# Altium project T0017_HPC_UFL_DEBUG_BOARD.PrjPcb (part 1 of 2)
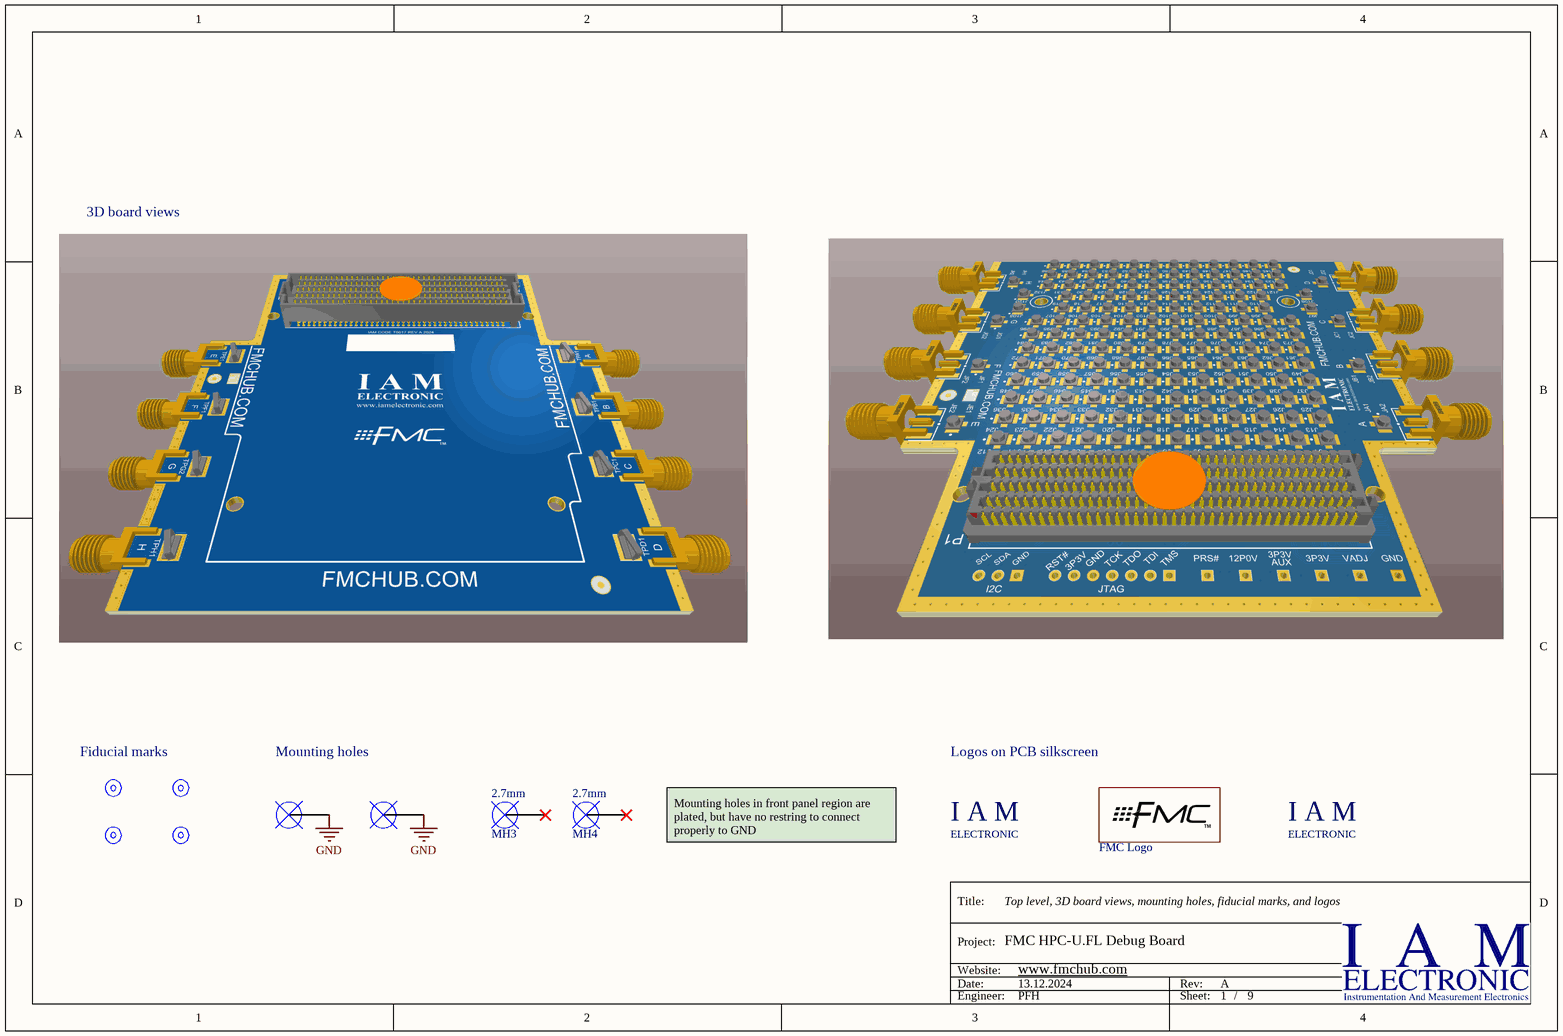
[diagram p0: FMC_HPC_UFL_DEBUG_TOP.SchDoc]
9 sheets, 201 parts. Net scope: global (net labels, ports and power ports of the same name join across sheets).
Board file: FMC_HPC_UFL_DEBUG_BOARD.PcbDoc
Sheets:
  FMC_HPC_UFL_DEBUG_TOP.SchDoc
  FMC_HPC_UFL_DEBUG_J1_J84.SchDoc
  FMC_HPC_UFL_DEBUG_J85_J156.SchDoc
  FMC_HPC_UFL_DEBUG_TP_SMA.SchDoc
  FMC_HPC_UFL_DEBUG_HPC_AB.SchDoc
  FMC_HPC_UFL_DEBUG_HPC_CD.SchDoc
  FMC_HPC_UFL_DEBUG_HPC_EF.SchDoc
  FMC_HPC_UFL_DEBUG_HPC_GH.SchDoc
  FMC_HPC_UFL_DEBUG_HPC_JK.SchDoc

## Sheet FMC_HPC_UFL_DEBUG_TOP.SchDoc: Top level, 3D board views, mounting holes, fiducial marks, and logos
size A4; Date: 13.12.2024; ApprovedBy: PFH; CompanyName: IAM Electronic GmbH; DrawnBy: PFH; Engineer: PFH; DocumentNumber: 1; Revision: A; SheetNumber: 1; SheetTotal: 9; Projekt: FMC HPC-U.FL Debug Board; Website: www.fmchub.com

### Parts
FM1  1mm  [FIDUCIAL_MARK_ROUND_RING]  (value not drawn)  (no BOM)
FM2  1mm  [FIDUCIAL_MARK_ROUND_RING]  (value not drawn)  (no BOM)
FM3  1mm  [FIDUCIAL_MARK_ROUND_RING]  (value not drawn)  (no BOM)
FM4  1mm  [FIDUCIAL_MARK_ROUND_RING]  (value not drawn)  (no BOM)
MH1  2.7mm  [Mounting_Hole_Plated_2.7mm-COVERED]  (value not drawn)  (no BOM)
MH2  2.7mm  [Mounting_Hole_Plated_2.7mm-COVERED]  (value not drawn)  (no BOM)
MH3  2.7mm  [Mounting_Hole_Plated_2.7mm - d3.1mm]  (no BOM)
MH4  2.7mm  [Mounting_Hole_Plated_2.7mm - d3.1mm]  (no BOM)
STR1  IAM LOGO  [IAM LOGO - LARGE - WWW]  (value not drawn)  (no BOM)
STR2  FMC Logo  [FMC_TM_LOGO_MEDIUM]  (no BOM)
STR3  IAM LOGO  [IAM LOGO - SMALL - WWW]  (value not drawn)  (no BOM)

### Nets
GND: MH1.0 MH2.0

Not connected (* = marked no-connect by the designer): FM1 FD0; FM2 FD0; FM3 FD0; FM4 FD0; MH3 0*; MH4 0*

### Notes on the sheet
- 3D board views
- Fiducial marks
- Mounting holes
- Logos on PCB silkscreen
- Mounting holes in front panel region are plated, but have no restring to connect properly to GND
- Title:
- Project:
- Date:
- Website:
- Rev:
- Engineer:
- Sheet:
- /
- (in symbol IAM_LOGO) I A M; ELECTRONIC

### Library data of the parts
FM1-FM4 = Fiducial_Mark: Fiducial mark, width 1mm, clearance 3mm; Width: 1 mm; Clearance: 3 mm
MH1-MH4 = Mounting_Hole_2.7mm: Mounting hole, hole size 2.7mm; Hole radius: 2.7 mm; Diameter (plated): *; Keep out (radius): *; Plated: *
STR1 STR3 = IAM_LOGO: I A M E L E C T R O N I C - Logo; Layer: Top Overlay; Manufacturer: IAM ELECTRONIC; Part: Logo
STR2 = FMC_Logo: VITA FMC Logo

## Sheet FMC_HPC_UFL_DEBUG_J1_J84.SchDoc: 84 U.FL connectors J1 .. J84 (12 x 7 array)
size A4; Date: 13.12.2024; ApprovedBy: PFH; CompanyName: IAM Electronic GmbH; DrawnBy: PFH; Engineer: PFH; DocumentNumber: 2; Revision: A; SheetNumber: 2; SheetTotal: 9; Projekt: FMC HPC-U.FL Debug Board; Website: www.fmchub.com
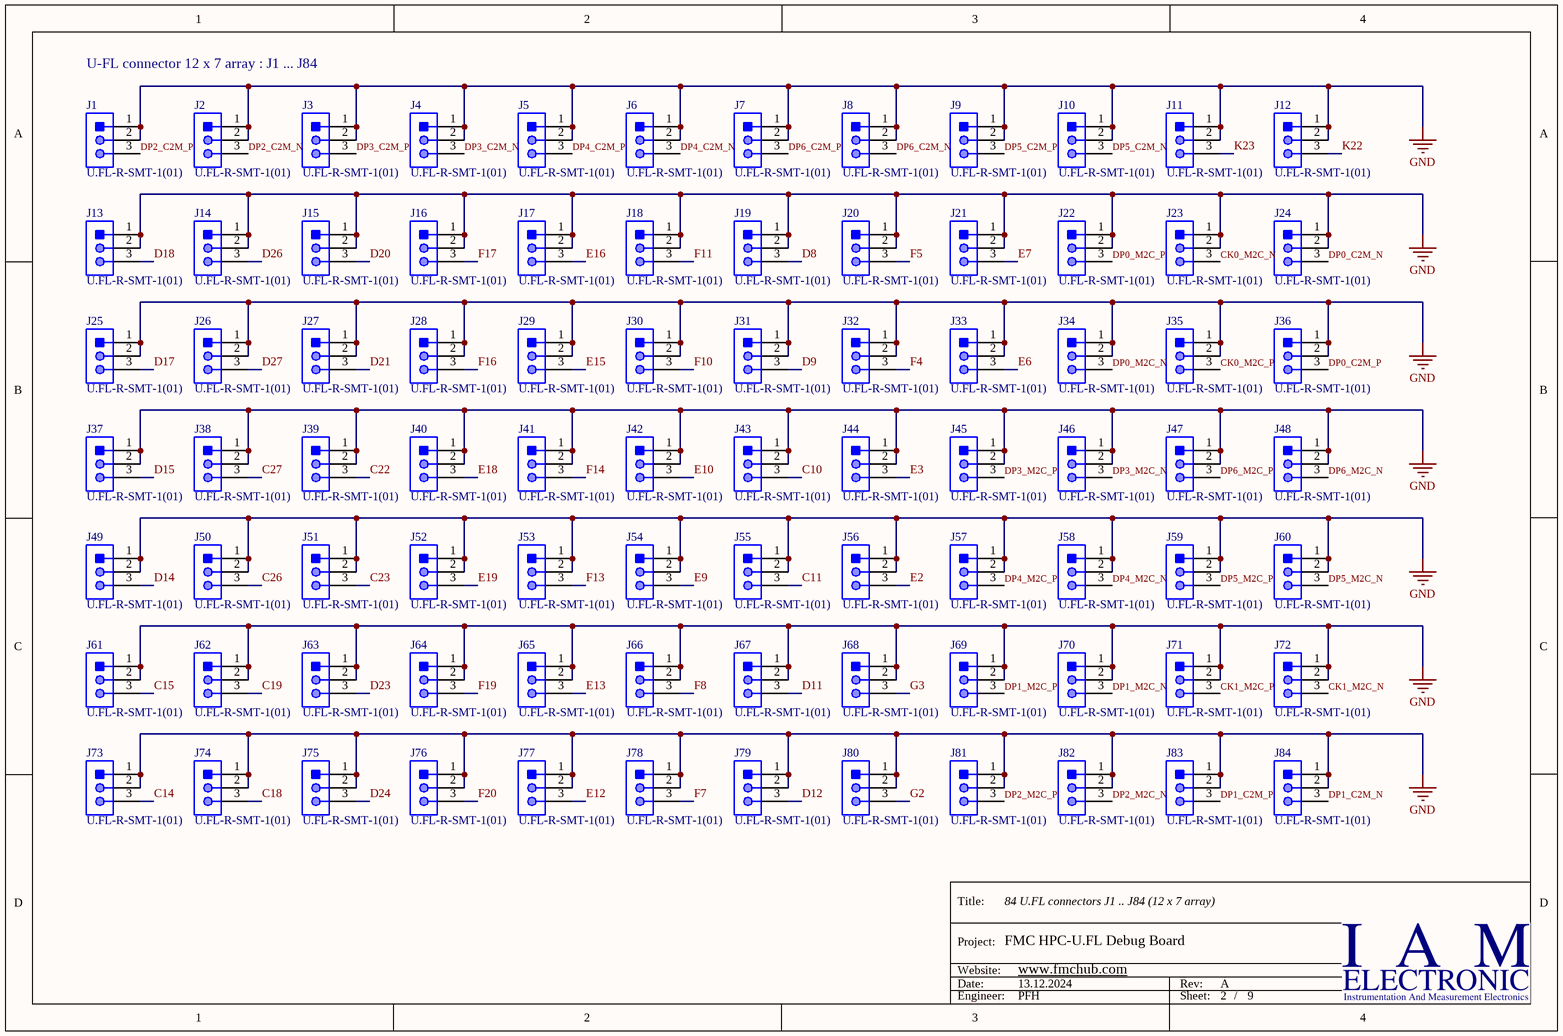
[diagram p1: FMC_HPC_UFL_DEBUG_J1_J84.SchDoc]

### Parts
J1  U.FL-R-SMT-1(01)  [HRS-U.FL-R-SMT-3_V]
J2  U.FL-R-SMT-1(01)  [HRS-U.FL-R-SMT-3_V]
J3  U.FL-R-SMT-1(01)  [HRS-U.FL-R-SMT-3_V]
J4  U.FL-R-SMT-1(01)  [HRS-U.FL-R-SMT-3_V]
J5  U.FL-R-SMT-1(01)  [HRS-U.FL-R-SMT-3_V]
J6  U.FL-R-SMT-1(01)  [HRS-U.FL-R-SMT-3_V]
J7  U.FL-R-SMT-1(01)  [HRS-U.FL-R-SMT-3_V]
J8  U.FL-R-SMT-1(01)  [HRS-U.FL-R-SMT-3_V]
J9  U.FL-R-SMT-1(01)  [HRS-U.FL-R-SMT-3_V]
J10  U.FL-R-SMT-1(01)  [HRS-U.FL-R-SMT-3_V]
J11  U.FL-R-SMT-1(01)  [HRS-U.FL-R-SMT-3_V]
J12  U.FL-R-SMT-1(01)  [HRS-U.FL-R-SMT-3_V]
J13  U.FL-R-SMT-1(01)  [HRS-U.FL-R-SMT-3_V]
J14  U.FL-R-SMT-1(01)  [HRS-U.FL-R-SMT-3_V]
J15  U.FL-R-SMT-1(01)  [HRS-U.FL-R-SMT-3_V]
J16  U.FL-R-SMT-1(01)  [HRS-U.FL-R-SMT-3_V]
J17  U.FL-R-SMT-1(01)  [HRS-U.FL-R-SMT-3_V]
J18  U.FL-R-SMT-1(01)  [HRS-U.FL-R-SMT-3_V]
J19  U.FL-R-SMT-1(01)  [HRS-U.FL-R-SMT-3_V]
J20  U.FL-R-SMT-1(01)  [HRS-U.FL-R-SMT-3_V]
J21  U.FL-R-SMT-1(01)  [HRS-U.FL-R-SMT-3_V]
J22  U.FL-R-SMT-1(01)  [HRS-U.FL-R-SMT-3_V]
J23  U.FL-R-SMT-1(01)  [HRS-U.FL-R-SMT-3_V]
J24  U.FL-R-SMT-1(01)  [HRS-U.FL-R-SMT-3_V]
J25  U.FL-R-SMT-1(01)  [HRS-U.FL-R-SMT-3_V]
J26  U.FL-R-SMT-1(01)  [HRS-U.FL-R-SMT-3_V]
J27  U.FL-R-SMT-1(01)  [HRS-U.FL-R-SMT-3_V]
J28  U.FL-R-SMT-1(01)  [HRS-U.FL-R-SMT-3_V]
J29  U.FL-R-SMT-1(01)  [HRS-U.FL-R-SMT-3_V]
J30  U.FL-R-SMT-1(01)  [HRS-U.FL-R-SMT-3_V]
J31  U.FL-R-SMT-1(01)  [HRS-U.FL-R-SMT-3_V]
J32  U.FL-R-SMT-1(01)  [HRS-U.FL-R-SMT-3_V]
J33  U.FL-R-SMT-1(01)  [HRS-U.FL-R-SMT-3_V]
J34  U.FL-R-SMT-1(01)  [HRS-U.FL-R-SMT-3_V]
J35  U.FL-R-SMT-1(01)  [HRS-U.FL-R-SMT-3_V]
J36  U.FL-R-SMT-1(01)  [HRS-U.FL-R-SMT-3_V]
J37  U.FL-R-SMT-1(01)  [HRS-U.FL-R-SMT-3_V]
J38  U.FL-R-SMT-1(01)  [HRS-U.FL-R-SMT-3_V]
J39  U.FL-R-SMT-1(01)  [HRS-U.FL-R-SMT-3_V]
J40  U.FL-R-SMT-1(01)  [HRS-U.FL-R-SMT-3_V]
J41  U.FL-R-SMT-1(01)  [HRS-U.FL-R-SMT-3_V]
J42  U.FL-R-SMT-1(01)  [HRS-U.FL-R-SMT-3_V]
J43  U.FL-R-SMT-1(01)  [HRS-U.FL-R-SMT-3_V]
J44  U.FL-R-SMT-1(01)  [HRS-U.FL-R-SMT-3_V]
J45  U.FL-R-SMT-1(01)  [HRS-U.FL-R-SMT-3_V]
J46  U.FL-R-SMT-1(01)  [HRS-U.FL-R-SMT-3_V]
J47  U.FL-R-SMT-1(01)  [HRS-U.FL-R-SMT-3_V]
J48  U.FL-R-SMT-1(01)  [HRS-U.FL-R-SMT-3_V]
J49  U.FL-R-SMT-1(01)  [HRS-U.FL-R-SMT-3_V]
J50  U.FL-R-SMT-1(01)  [HRS-U.FL-R-SMT-3_V]
J51  U.FL-R-SMT-1(01)  [HRS-U.FL-R-SMT-3_V]
J52  U.FL-R-SMT-1(01)  [HRS-U.FL-R-SMT-3_V]
J53  U.FL-R-SMT-1(01)  [HRS-U.FL-R-SMT-3_V]
J54  U.FL-R-SMT-1(01)  [HRS-U.FL-R-SMT-3_V]
J55  U.FL-R-SMT-1(01)  [HRS-U.FL-R-SMT-3_V]
J56  U.FL-R-SMT-1(01)  [HRS-U.FL-R-SMT-3_V]
J57  U.FL-R-SMT-1(01)  [HRS-U.FL-R-SMT-3_V]
J58  U.FL-R-SMT-1(01)  [HRS-U.FL-R-SMT-3_V]
J59  U.FL-R-SMT-1(01)  [HRS-U.FL-R-SMT-3_V]
J60  U.FL-R-SMT-1(01)  [HRS-U.FL-R-SMT-3_V]
J61  U.FL-R-SMT-1(01)  [HRS-U.FL-R-SMT-3_V]
J62  U.FL-R-SMT-1(01)  [HRS-U.FL-R-SMT-3_V]
J63  U.FL-R-SMT-1(01)  [HRS-U.FL-R-SMT-3_V]
J64  U.FL-R-SMT-1(01)  [HRS-U.FL-R-SMT-3_V]
J65  U.FL-R-SMT-1(01)  [HRS-U.FL-R-SMT-3_V]
J66  U.FL-R-SMT-1(01)  [HRS-U.FL-R-SMT-3_V]
J67  U.FL-R-SMT-1(01)  [HRS-U.FL-R-SMT-3_V]
J68  U.FL-R-SMT-1(01)  [HRS-U.FL-R-SMT-3_V]
J69  U.FL-R-SMT-1(01)  [HRS-U.FL-R-SMT-3_V]
J70  U.FL-R-SMT-1(01)  [HRS-U.FL-R-SMT-3_V]
J71  U.FL-R-SMT-1(01)  [HRS-U.FL-R-SMT-3_V]
J72  U.FL-R-SMT-1(01)  [HRS-U.FL-R-SMT-3_V]
J73  U.FL-R-SMT-1(01)  [HRS-U.FL-R-SMT-3_V]
J74  U.FL-R-SMT-1(01)  [HRS-U.FL-R-SMT-3_V]
J75  U.FL-R-SMT-1(01)  [HRS-U.FL-R-SMT-3_V]
J76  U.FL-R-SMT-1(01)  [HRS-U.FL-R-SMT-3_V]
J77  U.FL-R-SMT-1(01)  [HRS-U.FL-R-SMT-3_V]
J78  U.FL-R-SMT-1(01)  [HRS-U.FL-R-SMT-3_V]
J79  U.FL-R-SMT-1(01)  [HRS-U.FL-R-SMT-3_V]
J80  U.FL-R-SMT-1(01)  [HRS-U.FL-R-SMT-3_V]
J81  U.FL-R-SMT-1(01)  [HRS-U.FL-R-SMT-3_V]
J82  U.FL-R-SMT-1(01)  [HRS-U.FL-R-SMT-3_V]
J83  U.FL-R-SMT-1(01)  [HRS-U.FL-R-SMT-3_V]
J84  U.FL-R-SMT-1(01)  [HRS-U.FL-R-SMT-3_V]

### Nets
GND: J1.1 J1.2 J2.1 J2.2 J3.1 J3.2 J4.1 J4.2 J5.1 J5.2 J6.1 J6.2 J7.1 J7.2 J8.1 J8.2 J9.1 J9.2 J10.1 J10.2 J11.1 J11.2 J12.1 J12.2 J13.1 J13.2 J14.1 J14.2 J15.1 J15.2 J16.1 J16.2 J17.1 J17.2 J18.1 J18.2 J19.1 J19.2 J20.1 J20.2 J21.1 J21.2 J22.1 J22.2 J23.1 J23.2 J24.1 J24.2 J25.1 J25.2 J26.1 J26.2 J27.1 J27.2 J28.1 J28.2 J29.1 J29.2 J30.1 J30.2 J31.1 J31.2 J32.1 J32.2 J33.1 J33.2 J34.1 J34.2 J35.1 J35.2 J36.1 J36.2 J37.1 J37.2 J38.1 J38.2 J39.1 J39.2 J40.1 J40.2 J41.1 J41.2 J42.1 J42.2 J43.1 J43.2 J44.1 J44.2 J45.1 J45.2 J46.1 J46.2 J47.1 J47.2 J48.1 J48.2 J49.1 J49.2 J50.1 J50.2 J51.1 J51.2 J52.1 J52.2 J53.1 J53.2 J54.1 J54.2 J55.1 J55.2 J56.1 J56.2 J57.1 J57.2 J58.1 J58.2 J59.1 J59.2 J60.1 J60.2 J61.1 J61.2 J62.1 J62.2 J63.1 J63.2 J64.1 J64.2 J65.1 J65.2 J66.1 J66.2 J67.1 J67.2 J68.1 J68.2 J69.1 J69.2 J70.1 J70.2 J71.1 J71.2 J72.1 J72.2 J73.1 J73.2 J74.1 J74.2 J75.1 J75.2 J76.1 J76.2 J77.1 J77.2 J78.1 J78.2 J79.1 J79.2 J80.1 J80.2 J81.1 J81.2 J82.1 J82.2 J83.1 J83.2 J84.1 J84.2
C10: J43.3
C11: J55.3
C14: J73.3
C15: J61.3
C18: J74.3
C19: J62.3
C22: J39.3
C23: J51.3
C26: J50.3
C27: J38.3
CK0_M2C_N: J23.3
CK0_M2C_P: J35.3
CK1_M2C_N: J72.3
CK1_M2C_P: J71.3
D8: J19.3
D9: J31.3
D11: J67.3
D12: J79.3
D14: J49.3
D15: J37.3
D17: J25.3
D18: J13.3
D20: J15.3
D21: J27.3
D23: J63.3
D24: J75.3
D26: J14.3
D27: J26.3
DP0_C2M_N: J24.3
DP0_C2M_P: J36.3
DP0_M2C_N: J34.3
DP0_M2C_P: J22.3
DP1_C2M_N: J84.3
DP1_C2M_P: J83.3
DP1_M2C_N: J70.3
DP1_M2C_P: J69.3
DP2_C2M_N: J2.3
DP2_C2M_P: J1.3
DP2_M2C_N: J82.3
DP2_M2C_P: J81.3
DP3_C2M_N: J4.3
DP3_C2M_P: J3.3
DP3_M2C_N: J46.3
DP3_M2C_P: J45.3
DP4_C2M_N: J6.3
DP4_C2M_P: J5.3
DP4_M2C_N: J58.3
DP4_M2C_P: J57.3
DP5_C2M_N: J10.3
DP5_C2M_P: J9.3
DP5_M2C_N: J60.3
DP5_M2C_P: J59.3
DP6_C2M_N: J8.3
DP6_C2M_P: J7.3
DP6_M2C_N: J48.3
DP6_M2C_P: J47.3
E2: J56.3
E3: J44.3
E6: J33.3
E7: J21.3
E9: J54.3
E10: J42.3
E12: J77.3
E13: J65.3
E15: J29.3
E16: J17.3
E18: J40.3
E19: J52.3
F4: J32.3
F5: J20.3
F7: J78.3
F8: J66.3
F10: J30.3
F11: J18.3
F13: J53.3
F14: J41.3
F16: J28.3
F17: J16.3
F19: J64.3
F20: J76.3
G2: J80.3
G3: J68.3
K22: J12.3
K23: J11.3

### Notes on the sheet
- U-FL connector 12 x 7 array : J1 ... J84
- Title:
- Project:
- Date:
- Website:
- Rev:
- Engineer:
- Sheet:
- /

### Library data of the parts
J1-J84 = CMP-2000-05153-1: Ultra Small Coaxial Connector, 6 GHz, -40 to 90 degC, 3-Pin SMD, RoHS, Bulk; Manufacturer: Hirose Electric; Connector Style: U.FL; Impedance: 50Ohm; Dielectric Material: LiquidCrystalPolymer(LCP); Minimum Quantity: UltraMiniatureCoaxial; Online Catalog: U.FLSeries; Featured Product: HiroseU.FLSeries; Frequency - Max: 6GHz; Other Names: H122041 / U.FL-R-SMT-1(01)-ND; Contact Termination: Solder; Body Material: PhosphorBronze; Connector Type: Jack,MalePin; Body Finish: Silver; Center Contact Plating: Gold; Manufacturer URL: https://www.hirose.com; Family: CoaxialConnectors(RF); Fastening Type: Snap-On; Unit PriceUSD: U.FL; Series: U.FL; Package Reference: U.FL-R-SMT; Packaging: Bulk; Standard Package: 100; Mounting Type: SurfaceMount; Quantity Available: Bulk; Housing Color: Silver; Package Description: 3-Pin Surface Mount Device, Body 2.6 x 2.6 mm; Category: Connectors,Interconnects; Operating Temperature: -40degC~90degC; Center Contact Material: PhosphorBronze; Dynamic Catalog: U.FLSeries; Datasheet URL: https://datasheet.ciiva.com/26945/getdatasheetpartid-475239-26945414.pdf; Datasheet Version: Feb-09; Shield Termination: Solder; Part: U.FL-R-SMT-1(01); Part2: 331-0472-2 01

## Sheet FMC_HPC_UFL_DEBUG_J85_J156.SchDoc: 72 U.FL connectors J85 .. J144 (12 x 6 array)
size A4; Date: 13.12.2024; ApprovedBy: PFH; CompanyName: IAM Electronic GmbH; DrawnBy: PFH; Engineer: PFH; DocumentNumber: 3; Revision: A; SheetNumber: 3; SheetTotal: 9; Projekt: FMC HPC-U.FL Debug Board; Website: www.fmchub.com
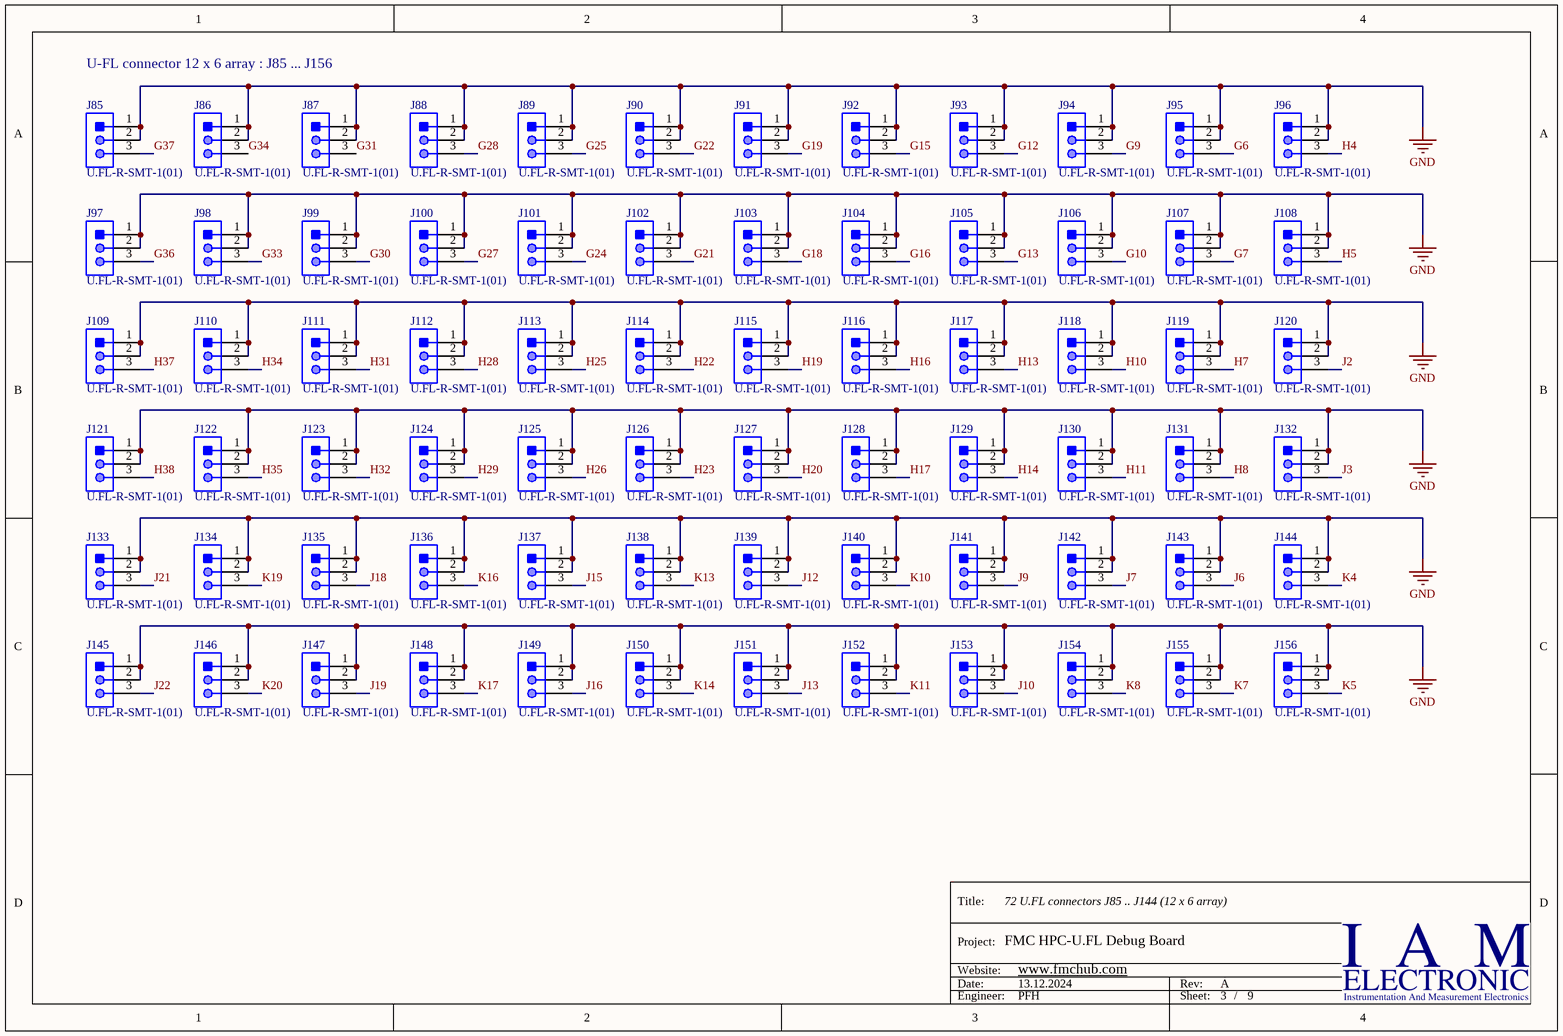
[diagram p2: FMC_HPC_UFL_DEBUG_J85_J156.SchDoc]

### Parts
J85  U.FL-R-SMT-1(01)  [HRS-U.FL-R-SMT-3_V]
J86  U.FL-R-SMT-1(01)  [HRS-U.FL-R-SMT-3_V]
J87  U.FL-R-SMT-1(01)  [HRS-U.FL-R-SMT-3_V]
J88  U.FL-R-SMT-1(01)  [HRS-U.FL-R-SMT-3_V]
J89  U.FL-R-SMT-1(01)  [HRS-U.FL-R-SMT-3_V]
J90  U.FL-R-SMT-1(01)  [HRS-U.FL-R-SMT-3_V]
J91  U.FL-R-SMT-1(01)  [HRS-U.FL-R-SMT-3_V]
J92  U.FL-R-SMT-1(01)  [HRS-U.FL-R-SMT-3_V]
J93  U.FL-R-SMT-1(01)  [HRS-U.FL-R-SMT-3_V]
J94  U.FL-R-SMT-1(01)  [HRS-U.FL-R-SMT-3_V]
J95  U.FL-R-SMT-1(01)  [HRS-U.FL-R-SMT-3_V]
J96  U.FL-R-SMT-1(01)  [HRS-U.FL-R-SMT-3_V]
J97  U.FL-R-SMT-1(01)  [HRS-U.FL-R-SMT-3_V]
J98  U.FL-R-SMT-1(01)  [HRS-U.FL-R-SMT-3_V]
J99  U.FL-R-SMT-1(01)  [HRS-U.FL-R-SMT-3_V]
J100  U.FL-R-SMT-1(01)  [HRS-U.FL-R-SMT-3_V]
J101  U.FL-R-SMT-1(01)  [HRS-U.FL-R-SMT-3_V]
J102  U.FL-R-SMT-1(01)  [HRS-U.FL-R-SMT-3_V]
J103  U.FL-R-SMT-1(01)  [HRS-U.FL-R-SMT-3_V]
J104  U.FL-R-SMT-1(01)  [HRS-U.FL-R-SMT-3_V]
J105  U.FL-R-SMT-1(01)  [HRS-U.FL-R-SMT-3_V]
J106  U.FL-R-SMT-1(01)  [HRS-U.FL-R-SMT-3_V]
J107  U.FL-R-SMT-1(01)  [HRS-U.FL-R-SMT-3_V]
J108  U.FL-R-SMT-1(01)  [HRS-U.FL-R-SMT-3_V]
J109  U.FL-R-SMT-1(01)  [HRS-U.FL-R-SMT-3_V]
J110  U.FL-R-SMT-1(01)  [HRS-U.FL-R-SMT-3_V]
J111  U.FL-R-SMT-1(01)  [HRS-U.FL-R-SMT-3_V]
J112  U.FL-R-SMT-1(01)  [HRS-U.FL-R-SMT-3_V]
J113  U.FL-R-SMT-1(01)  [HRS-U.FL-R-SMT-3_V]
J114  U.FL-R-SMT-1(01)  [HRS-U.FL-R-SMT-3_V]
J115  U.FL-R-SMT-1(01)  [HRS-U.FL-R-SMT-3_V]
J116  U.FL-R-SMT-1(01)  [HRS-U.FL-R-SMT-3_V]
J117  U.FL-R-SMT-1(01)  [HRS-U.FL-R-SMT-3_V]
J118  U.FL-R-SMT-1(01)  [HRS-U.FL-R-SMT-3_V]
J119  U.FL-R-SMT-1(01)  [HRS-U.FL-R-SMT-3_V]
J120  U.FL-R-SMT-1(01)  [HRS-U.FL-R-SMT-3_V]
J121  U.FL-R-SMT-1(01)  [HRS-U.FL-R-SMT-3_V]
J122  U.FL-R-SMT-1(01)  [HRS-U.FL-R-SMT-3_V]
J123  U.FL-R-SMT-1(01)  [HRS-U.FL-R-SMT-3_V]
J124  U.FL-R-SMT-1(01)  [HRS-U.FL-R-SMT-3_V]
J125  U.FL-R-SMT-1(01)  [HRS-U.FL-R-SMT-3_V]
J126  U.FL-R-SMT-1(01)  [HRS-U.FL-R-SMT-3_V]
J127  U.FL-R-SMT-1(01)  [HRS-U.FL-R-SMT-3_V]
J128  U.FL-R-SMT-1(01)  [HRS-U.FL-R-SMT-3_V]
J129  U.FL-R-SMT-1(01)  [HRS-U.FL-R-SMT-3_V]
J130  U.FL-R-SMT-1(01)  [HRS-U.FL-R-SMT-3_V]
J131  U.FL-R-SMT-1(01)  [HRS-U.FL-R-SMT-3_V]
J132  U.FL-R-SMT-1(01)  [HRS-U.FL-R-SMT-3_V]
J133  U.FL-R-SMT-1(01)  [HRS-U.FL-R-SMT-3_V]
J134  U.FL-R-SMT-1(01)  [HRS-U.FL-R-SMT-3_V]
J135  U.FL-R-SMT-1(01)  [HRS-U.FL-R-SMT-3_V]
J136  U.FL-R-SMT-1(01)  [HRS-U.FL-R-SMT-3_V]
J137  U.FL-R-SMT-1(01)  [HRS-U.FL-R-SMT-3_V]
J138  U.FL-R-SMT-1(01)  [HRS-U.FL-R-SMT-3_V]
J139  U.FL-R-SMT-1(01)  [HRS-U.FL-R-SMT-3_V]
J140  U.FL-R-SMT-1(01)  [HRS-U.FL-R-SMT-3_V]
J141  U.FL-R-SMT-1(01)  [HRS-U.FL-R-SMT-3_V]
J142  U.FL-R-SMT-1(01)  [HRS-U.FL-R-SMT-3_V]
J143  U.FL-R-SMT-1(01)  [HRS-U.FL-R-SMT-3_V]
J144  U.FL-R-SMT-1(01)  [HRS-U.FL-R-SMT-3_V]
J145  U.FL-R-SMT-1(01)  [HRS-U.FL-R-SMT-3_V]
J146  U.FL-R-SMT-1(01)  [HRS-U.FL-R-SMT-3_V]
J147  U.FL-R-SMT-1(01)  [HRS-U.FL-R-SMT-3_V]
J148  U.FL-R-SMT-1(01)  [HRS-U.FL-R-SMT-3_V]
J149  U.FL-R-SMT-1(01)  [HRS-U.FL-R-SMT-3_V]
J150  U.FL-R-SMT-1(01)  [HRS-U.FL-R-SMT-3_V]
J151  U.FL-R-SMT-1(01)  [HRS-U.FL-R-SMT-3_V]
J152  U.FL-R-SMT-1(01)  [HRS-U.FL-R-SMT-3_V]
J153  U.FL-R-SMT-1(01)  [HRS-U.FL-R-SMT-3_V]
J154  U.FL-R-SMT-1(01)  [HRS-U.FL-R-SMT-3_V]
J155  U.FL-R-SMT-1(01)  [HRS-U.FL-R-SMT-3_V]
J156  U.FL-R-SMT-1(01)  [HRS-U.FL-R-SMT-3_V]

### Nets
GND: J85.1 J85.2 J86.1 J86.2 J87.1 J87.2 J88.1 J88.2 J89.1 J89.2 J90.1 J90.2 J91.1 J91.2 J92.1 J92.2 J93.1 J93.2 J94.1 J94.2 J95.1 J95.2 J96.1 J96.2 J97.1 J97.2 J98.1 J98.2 J99.1 J99.2 J100.1 J100.2 J101.1 J101.2 J102.1 J102.2 J103.1 J103.2 J104.1 J104.2 J105.1 J105.2 J106.1 J106.2 J107.1 J107.2 J108.1 J108.2 J109.1 J109.2 J110.1 J110.2 J111.1 J111.2 J112.1 J112.2 J113.1 J113.2 J114.1 J114.2 J115.1 J115.2 J116.1 J116.2 J117.1 J117.2 J118.1 J118.2 J119.1 J119.2 J120.1 J120.2 J121.1 J121.2 J122.1 J122.2 J123.1 J123.2 J124.1 J124.2 J125.1 J125.2 J126.1 J126.2 J127.1 J127.2 J128.1 J128.2 J129.1 J129.2 J130.1 J130.2 J131.1 J131.2 J132.1 J132.2 J133.1 J133.2 J134.1 J134.2 J135.1 J135.2 J136.1 J136.2 J137.1 J137.2 J138.1 J138.2 J139.1 J139.2 J140.1 J140.2 J141.1 J141.2 J142.1 J142.2 J143.1 J143.2 J144.1 J144.2 J145.1 J145.2 J146.1 J146.2 J147.1 J147.2 J148.1 J148.2 J149.1 J149.2 J150.1 J150.2 J151.1 J151.2 J152.1 J152.2 J153.1 J153.2 J154.1 J154.2 J155.1 J155.2 J156.1 J156.2
G6: J95.3
G7: J107.3
G9: J94.3
G10: J106.3
G12: J93.3
G13: J105.3
G15: J92.3
G16: J104.3
G18: J103.3
G19: J91.3
G21: J102.3
G22: J90.3
G24: J101.3
G25: J89.3
G27: J100.3
G28: J88.3
G30: J99.3
G31: J87.3
G33: J98.3
G34: J86.3
G36: J97.3
G37: J85.3
H4: J96.3
H5: J108.3
H7: J119.3
H8: J131.3
H10: J118.3
H11: J130.3
H13: J117.3
H14: J129.3
H16: J116.3
H17: J128.3
H19: J115.3
H20: J127.3
H22: J114.3
H23: J126.3
H25: J113.3
H26: J125.3
H28: J112.3
H29: J124.3
H31: J111.3
H32: J123.3
H34: J110.3
H35: J122.3
H37: J109.3
H38: J121.3
J2: J120.3
J3: J132.3
J6: J143.3
J7: J142.3
J9: J141.3
J10: J153.3
J12: J139.3
J13: J151.3
J15: J137.3
J16: J149.3
J18: J135.3
J19: J147.3
J21: J133.3
J22: J145.3
K4: J144.3
K5: J156.3
K7: J155.3
K8: J154.3
K10: J140.3
K11: J152.3
K13: J138.3
K14: J150.3
K16: J136.3
K17: J148.3
K19: J134.3
K20: J146.3

### Notes on the sheet
- U-FL connector 12 x 6 array : J85 ... J156
- Title:
- Project:
- Date:
- Website:
- Rev:
- Engineer:
- Sheet:
- /

### Library data of the parts
J85-J156 = CMP-2000-05153-1: as J1 on sheet FMC_HPC_UFL_DEBUG_J1_J84; Manufacturer URL: https://www.hirose.com; Family: CoaxialConnectors(RF); Fastening Type: Snap-On; Unit PriceUSD: U.FL; Series: U.FL; Package Reference: U.FL-R-SMT; Packaging: Bulk; Standard Package: 100; Mounting Type: SurfaceMount; Quantity Available: Bulk; Housing Color: Silver; Package Description: 3-Pin Surface Mount Device, Body 2.6 x 2.6 mm; Category: Connectors,Interconnects; Operating Temperature: -40degC~90degC; Center Contact Material: PhosphorBronze; Dynamic Catalog: U.FLSeries; Datasheet URL: https://datasheet.ciiva.com/26945/getdatasheetpartid-475239-26945414.pdf; Datasheet Version: Feb-09; Shield Termination: Solder; Part: U.FL-R-SMT-1(01); Part2: 331-0472-2 01

## Sheet FMC_HPC_UFL_DEBUG_TP_SMA.SchDoc: 8 SMA connector and U.FL connectors JA .. JH (4 x 2 array)
size A4; Date: 13.12.2024; ApprovedBy: PFH; CompanyName: IAM Electronic GmbH; DrawnBy: PFH; Engineer: PFH; DocumentNumber: 4; Revision: A; SheetNumber: 4; SheetTotal: 9; Projekt: FMC HPC-U.FL Debug Board; Website: www.fmchub.com
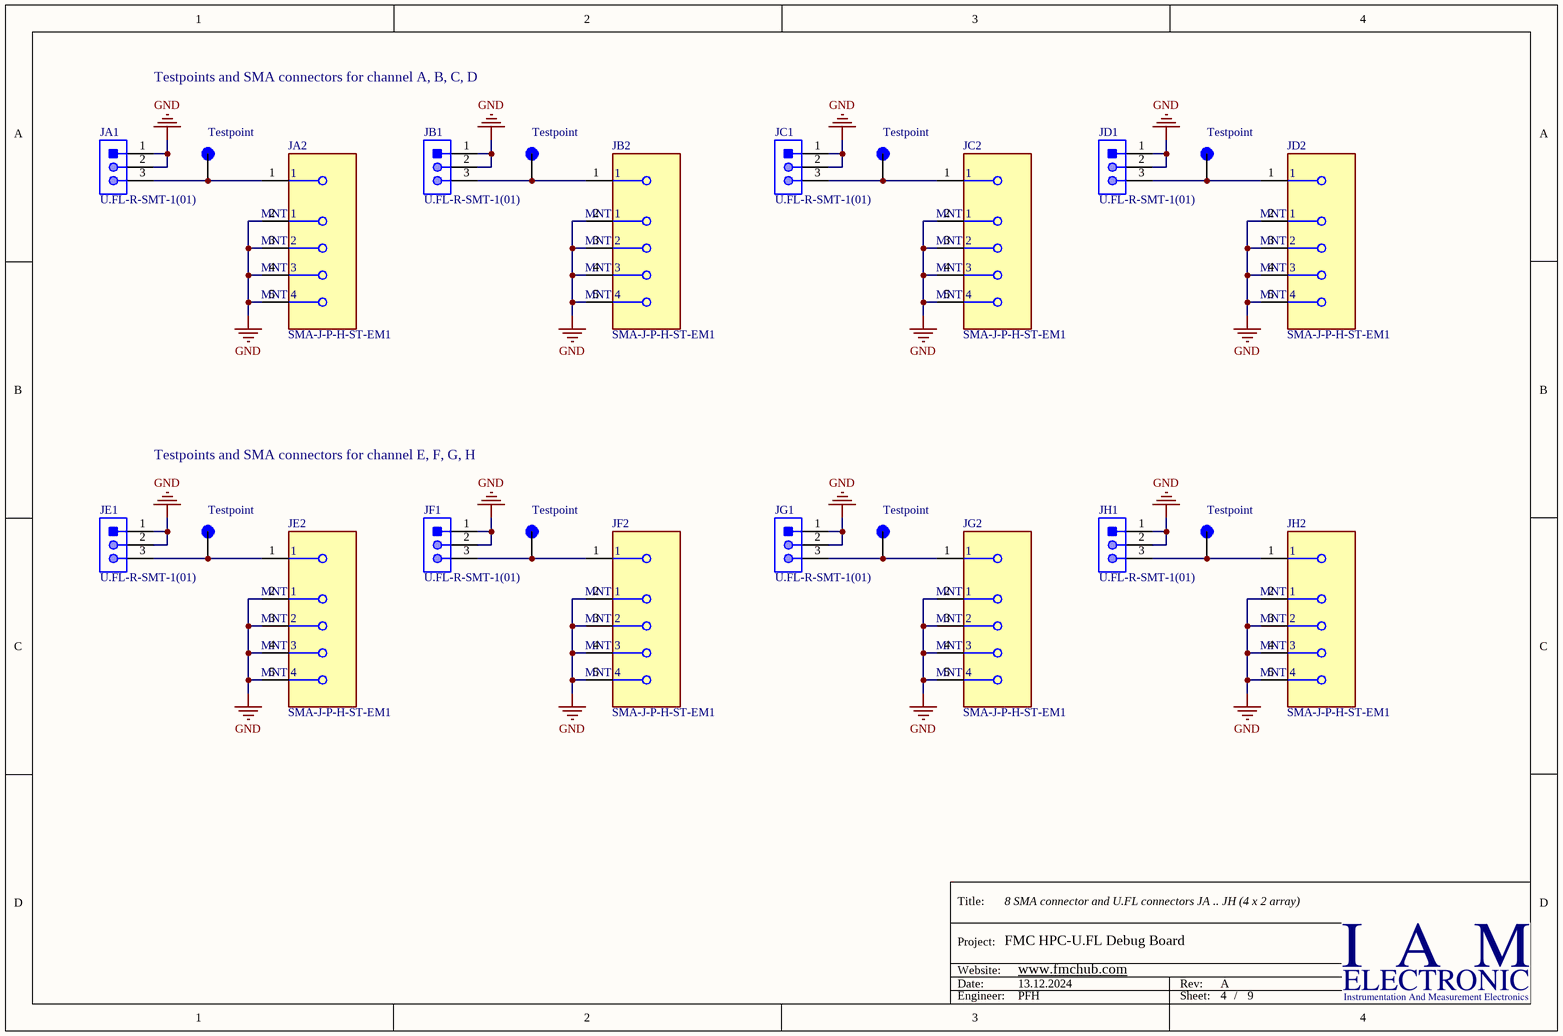
[diagram p3: FMC_HPC_UFL_DEBUG_TP_SMA.SchDoc]

### Parts
JA1  U.FL-R-SMT-1(01)  [HRS-U.FL-R-SMT-3_V]
JA2  SMA-J-P-H-ST-EM1  [FP-SMA-J-P-H-ST-EM1-MFG]
JB1  U.FL-R-SMT-1(01)  [HRS-U.FL-R-SMT-3_V]
JB2  SMA-J-P-H-ST-EM1  [FP-SMA-J-P-H-ST-EM1-MFG]
JC1  U.FL-R-SMT-1(01)  [HRS-U.FL-R-SMT-3_V]
JC2  SMA-J-P-H-ST-EM1  [FP-SMA-J-P-H-ST-EM1-MFG]
JD1  U.FL-R-SMT-1(01)  [HRS-U.FL-R-SMT-3_V]
JD2  SMA-J-P-H-ST-EM1  [FP-SMA-J-P-H-ST-EM1-MFG]
JE1  U.FL-R-SMT-1(01)  [HRS-U.FL-R-SMT-3_V]
JE2  SMA-J-P-H-ST-EM1  [FP-SMA-J-P-H-ST-EM1-MFG]
JF1  U.FL-R-SMT-1(01)  [HRS-U.FL-R-SMT-3_V]
JF2  SMA-J-P-H-ST-EM1  [FP-SMA-J-P-H-ST-EM1-MFG]
JG1  U.FL-R-SMT-1(01)  [HRS-U.FL-R-SMT-3_V]
JG2  SMA-J-P-H-ST-EM1  [FP-SMA-J-P-H-ST-EM1-MFG]
JH1  U.FL-R-SMT-1(01)  [HRS-U.FL-R-SMT-3_V]
JH2  SMA-J-P-H-ST-EM1  [FP-SMA-J-P-H-ST-EM1-MFG]
TPA1  Testpoint  [KEYSTONE_5095]
TPB1  Testpoint  [KEYSTONE_5095]
TPC1  Testpoint  [KEYSTONE_5095]
TPD1  Testpoint  [KEYSTONE_5095]
TPE1  Testpoint  [KEYSTONE_5095]
TPF1  Testpoint  [KEYSTONE_5095]
TPG2  Testpoint  [KEYSTONE_5095]
TPH1  Testpoint  [KEYSTONE_5095]

### Nets
GND: JA1.1 JA1.2 JA2.2(MNT_1) JA2.3(MNT_2) JA2.4(MNT_3) JA2.5(MNT_4) JB1.1 JB1.2 JB2.2(MNT_1) JB2.3(MNT_2) JB2.4(MNT_3) JB2.5(MNT_4) JC1.1 JC1.2 JC2.2(MNT_1) JC2.3(MNT_2) JC2.4(MNT_3) JC2.5(MNT_4) JD1.1 JD1.2 JD2.2(MNT_1) JD2.3(MNT_2) JD2.4(MNT_3) JD2.5(MNT_4) JE1.1 JE1.2 JE2.2(MNT_1) JE2.3(MNT_2) JE2.4(MNT_3) JE2.5(MNT_4) JF1.1 JF1.2 JF2.2(MNT_1) JF2.3(MNT_2) JF2.4(MNT_3) JF2.5(MNT_4) JG1.1 JG1.2 JG2.2(MNT_1) JG2.3(MNT_2) JG2.4(MNT_3) JG2.5(MNT_4) JH1.1 JH1.2 JH2.2(MNT_1) JH2.3(MNT_2) JH2.4(MNT_3) JH2.5(MNT_4)
NetJA1_3: JA1.3 JA2.1 TPA1.1(TP)
NetJB1_3: JB1.3 JB2.1 TPB1.1(TP)
NetJC1_3: JC1.3 JC2.1 TPC1.1(TP)
NetJD1_3: JD1.3 JD2.1 TPD1.1(TP)
NetJE1_3: JE1.3 JE2.1 TPE1.1(TP)
NetJF1_3: JF1.3 JF2.1 TPF1.1(TP)
NetJG1_3: JG1.3 JG2.1 TPG2.1(TP)
NetJH1_3: JH1.3 JH2.1 TPH1.1(TP)

### Notes on the sheet
- Testpoints and SMA connectors for channel A, B, C, D
- Testpoints and SMA connectors for channel E, F, G, H
- Title:
- Project:
- Date:
- Website:
- Rev:
- Engineer:
- Sheet:
- /

### Library data of the parts
JA1 JB1 JC1 JD1 JE1 JF1 JG1 JH1 = CMP-2000-05153-1: as J1 on sheet FMC_HPC_UFL_DEBUG_J1_J84; Manufacturer URL: https://www.hirose.com; Family: CoaxialConnectors(RF); Fastening Type: Snap-On; Unit PriceUSD: U.FL; Series: U.FL; Package Reference: U.FL-R-SMT; Packaging: Bulk; Standard Package: 100; Mounting Type: SurfaceMount; Quantity Available: Bulk; Housing Color: Silver; Package Description: 3-Pin Surface Mount Device, Body 2.6 x 2.6 mm; Category: Connectors,Interconnects; Operating Temperature: -40degC~90degC; Center Contact Material: PhosphorBronze; Dynamic Catalog: U.FLSeries; Datasheet URL: https://datasheet.ciiva.com/26945/getdatasheetpartid-475239-26945414.pdf; Datasheet Version: Feb-09; Shield Termination: Solder; Part: U.FL-R-SMT-1(01); Part2: 331-0472-2 01
JA2 JB2 JC2 JD2 JE2 JF2 JG2 JH2 = CMP-02754-000006-1: CONN SMA JACK STR 50OHM EDGE MNT; Manufacturer: Samtec; Dielectric Material: PTFE; Center Contact Plating: Gold; Max Frequency: 6GHz; Body Material: Brass; Voltage Rating: 335V; Impedance: 50R; Package Quantity: 1; Case/Package: SMA; Max Operating Temperature: 125°C; Fastening Type: Threaded; Orientation: Straight; Depth: 13.33mm; RoHS Compliant: Yes; Length: 6.35mm; Insulation Material: Polytetrafluoroethylene; Termination: Solder; Min Operating Temperature: -65°C; Housing Color: Gold; Contact Plating: Gold; Contact Material: Copper; Connector Type: SMA; Mount: Edge; Series: SMA; Packaging: Tray; Body Plating: Gold; Radiation Hardening: No; Part: SMA-J-P-H-ST-EM1
TPA1 TPB1 TPC1 TPD1 TPE1 TPF1 TPG2 TPH1 = 5095: PC TEST POINT COMPACT; Manufacturer: Keystone Electronics; Part: 5095; Package: None

## Sheet FMC_HPC_UFL_DEBUG_HPC_AB.SchDoc: HPC connector ROW A and ROW B
size A4; Date: 13.12.2024; ApprovedBy: PFH; CompanyName: IAM Electronic GmbH; DrawnBy: PFH; Engineer: PFH; DocumentNumber: 5; Revision: A; SheetNumber: 5; SheetTotal: 9; Projekt: FMC HPC-U.FL Debug Board; Website: www.fmchub.com
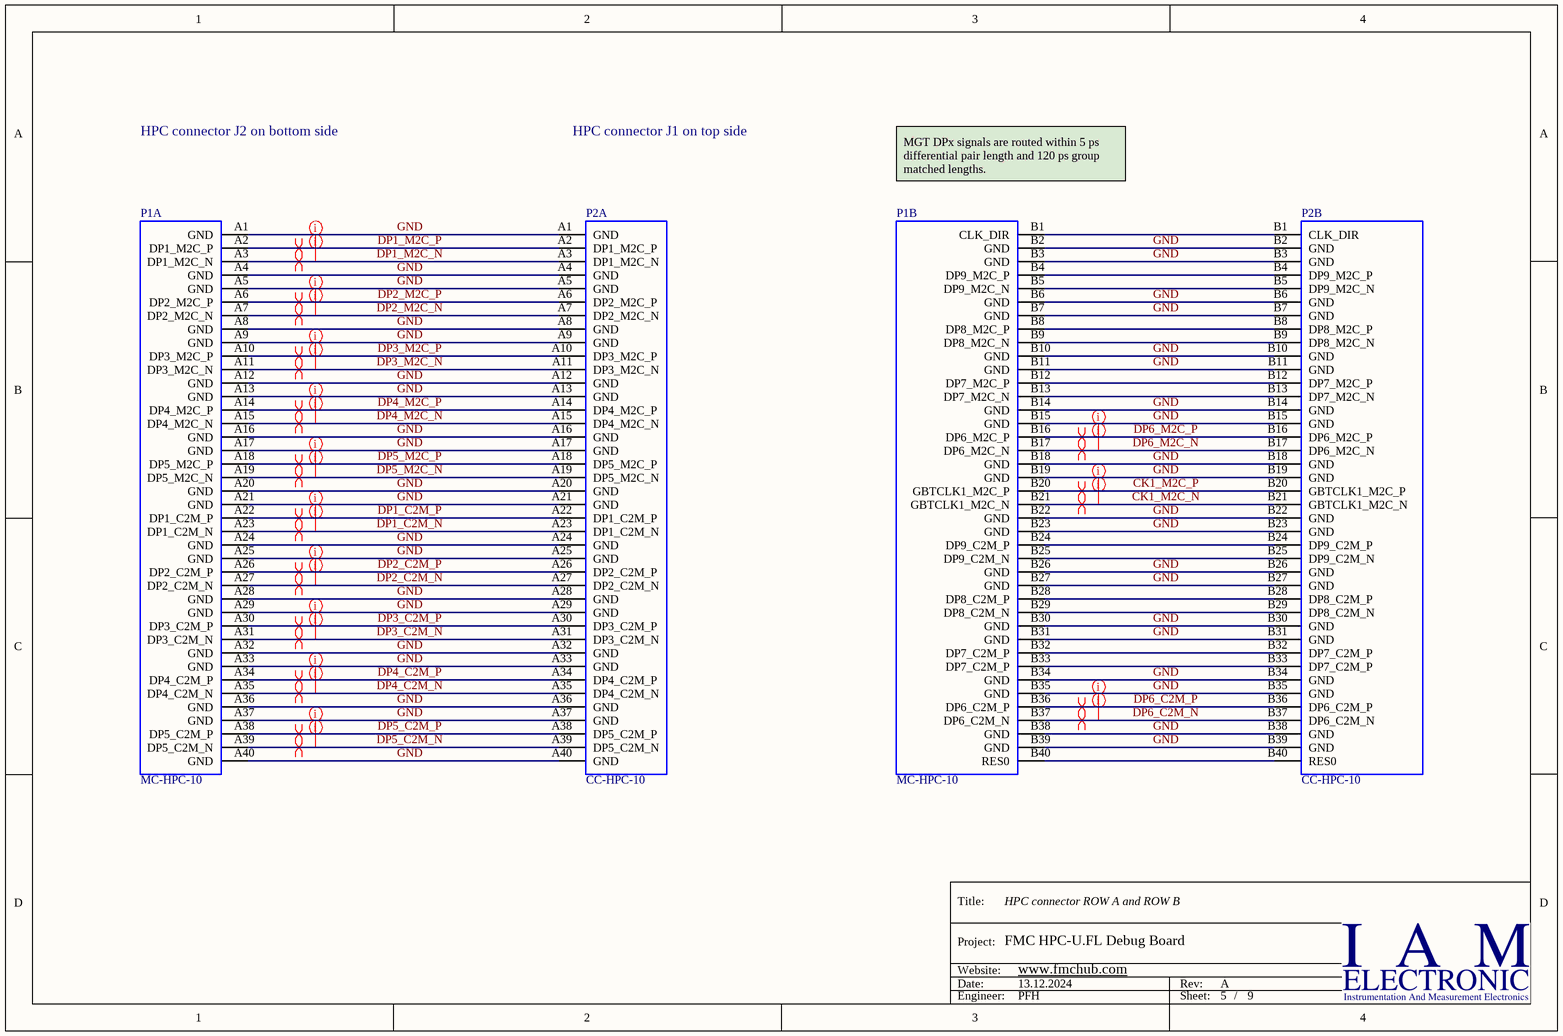
[diagram p4: FMC_HPC_UFL_DEBUG_HPC_AB.SchDoc]

### Parts
P1  MC-HPC-10  [ASP-134488-01]  (parts A,B of 10)
P2  CC-HPC-10  [ASP-134486-01]  (parts A,B of 10)

### Nets
GND: P1.A1(GND) P1.A4(GND) P1.A5(GND) P1.A8(GND) P1.A9(GND) P1.A12(GND) P1.A13(GND) P1.A16(GND) P1.A17(GND) P1.A20(GND) P1.A21(GND) P1.A24(GND) P1.A25(GND) P1.A28(GND) P1.A29(GND) P1.A32(GND) P1.A33(GND) P1.A36(GND) P1.A37(GND) P1.A40(GND) P1.B2(GND) P1.B3(GND) P1.B6(GND) P1.B7(GND) P1.B10(GND) P1.B11(GND) P1.B14(GND) P1.B15(GND) P1.B18(GND) P1.B19(GND) P1.B22(GND) P1.B23(GND) P1.B26(GND) P1.B27(GND) P1.B30(GND) P1.B31(GND) P1.B34(GND) P1.B35(GND) P1.B38(GND) P1.B39(GND) P2.A1(GND) P2.A4(GND) P2.A5(GND) P2.A8(GND) P2.A9(GND) P2.A12(GND) P2.A13(GND) P2.A16(GND) P2.A17(GND) P2.A20(GND) P2.A21(GND) P2.A24(GND) P2.A25(GND) P2.A28(GND) P2.A29(GND) P2.A32(GND) P2.A33(GND) P2.A36(GND) P2.A37(GND) P2.A40(GND) P2.B2(GND) P2.B3(GND) P2.B6(GND) P2.B7(GND) P2.B10(GND) P2.B11(GND) P2.B14(GND) P2.B15(GND) P2.B18(GND) P2.B19(GND) P2.B22(GND) P2.B23(GND) P2.B26(GND) P2.B27(GND) P2.B30(GND) P2.B31(GND) P2.B34(GND) P2.B35(GND) P2.B38(GND) P2.B39(GND)
CK1_M2C_N: P1.B21(GBTCLK1_M2C_N) P2.B21(GBTCLK1_M2C_N)
CK1_M2C_P: P1.B20(GBTCLK1_M2C_P) P2.B20(GBTCLK1_M2C_P)
DP1_C2M_N: P1.A23(DP1_C2M_N) P2.A23(DP1_C2M_N)
DP1_C2M_P: P1.A22(DP1_C2M_P) P2.A22(DP1_C2M_P)
DP1_M2C_N: P1.A3(DP1_M2C_N) P2.A3(DP1_M2C_N)
DP1_M2C_P: P1.A2(DP1_M2C_P) P2.A2(DP1_M2C_P)
DP2_C2M_N: P1.A27(DP2_C2M_N) P2.A27(DP2_C2M_N)
DP2_C2M_P: P1.A26(DP2_C2M_P) P2.A26(DP2_C2M_P)
DP2_M2C_N: P1.A7(DP2_M2C_N) P2.A7(DP2_M2C_N)
DP2_M2C_P: P1.A6(DP2_M2C_P) P2.A6(DP2_M2C_P)
DP3_C2M_N: P1.A31(DP3_C2M_N) P2.A31(DP3_C2M_N)
DP3_C2M_P: P1.A30(DP3_C2M_P) P2.A30(DP3_C2M_P)
DP3_M2C_N: P1.A11(DP3_M2C_N) P2.A11(DP3_M2C_N)
DP3_M2C_P: P1.A10(DP3_M2C_P) P2.A10(DP3_M2C_P)
DP4_C2M_N: P1.A35(DP4_C2M_N) P2.A35(DP4_C2M_N)
DP4_C2M_P: P1.A34(DP4_C2M_P) P2.A34(DP4_C2M_P)
DP4_M2C_N: P1.A15(DP4_M2C_N) P2.A15(DP4_M2C_N)
DP4_M2C_P: P1.A14(DP4_M2C_P) P2.A14(DP4_M2C_P)
DP5_C2M_N: P1.A39(DP5_C2M_N) P2.A39(DP5_C2M_N)
DP5_C2M_P: P1.A38(DP5_C2M_P) P2.A38(DP5_C2M_P)
DP5_M2C_N: P1.A19(DP5_M2C_N) P2.A19(DP5_M2C_N)
DP5_M2C_P: P1.A18(DP5_M2C_P) P2.A18(DP5_M2C_P)
DP6_C2M_N: P1.B37(DP6_C2M_N) P2.B37(DP6_C2M_N)
DP6_C2M_P: P1.B36(DP6_C2M_P) P2.B36(DP6_C2M_P)
DP6_M2C_N: P1.B17(DP6_M2C_N) P2.B17(DP6_M2C_N)
DP6_M2C_P: P1.B16(DP6_M2C_P) P2.B16(DP6_M2C_P)
NetP1_B1: P1.B1(CLK_DIR) P2.B1(CLK_DIR)
NetP1_B4: P1.B4(DP9_M2C_P) P2.B4(DP9_M2C_P)
NetP1_B5: P1.B5(DP9_M2C_N) P2.B5(DP9_M2C_N)
NetP1_B8: P1.B8(DP8_M2C_P) P2.B8(DP8_M2C_P)
NetP1_B9: P1.B9(DP8_M2C_N) P2.B9(DP8_M2C_N)
NetP1_B12: P1.B12(DP7_M2C_P) P2.B12(DP7_M2C_P)
NetP1_B13: P1.B13(DP7_M2C_N) P2.B13(DP7_M2C_N)
NetP1_B24: P1.B24(DP9_C2M_P) P2.B24(DP9_C2M_P)
NetP1_B25: P1.B25(DP9_C2M_N) P2.B25(DP9_C2M_N)
NetP1_B28: P1.B28(DP8_C2M_P) P2.B28(DP8_C2M_P)
NetP1_B29: P1.B29(DP8_C2M_N) P2.B29(DP8_C2M_N)
NetP1_B32: P1.B32(DP7_C2M_P) P2.B32(DP7_C2M_P)
NetP1_B33: P1.B33(DP7_C2M_P) P2.B33(DP7_C2M_P)
NetP1_B40: P1.B40(RES0) P2.B40(RES0)

### Layout directives
differential pair: CK1_M2C_N, CK1_M2C_P, DP1_C2M_N, DP1_C2M_P, DP1_M2C_N, DP1_M2C_P, DP2_C2M_N, DP2_C2M_P, DP2_M2C_N, DP2_M2C_P, DP3_C2M_N, DP3_C2M_P, DP3_M2C_N, DP3_M2C_P, DP4_C2M_N, DP4_C2M_P, DP4_M2C_N, DP4_M2C_P, DP5_C2M_N, DP5_C2M_P, DP5_M2C_N, DP5_M2C_P, DP6_C2M_N, DP6_C2M_P, DP6_M2C_N, DP6_M2C_P
net class MGT; rule Differential Pairs Routing [Pref Gap = 6mil    Min Gap  = 6mil    Max Gap  = 6milPref Width = 6mil    Min Width  = 4mil    Max Width  = 6mil]; rule Matched Net Lengths [Delay Tolerance = 120ps]: CK1_M2C_N, CK1_M2C_P, DP1_C2M_N, DP1_C2M_P, DP1_M2C_N, DP1_M2C_P, DP2_C2M_N, DP2_C2M_P, DP2_M2C_N, DP2_M2C_P, DP3_C2M_N, DP3_C2M_P, DP3_M2C_N, DP3_M2C_P, DP4_C2M_N, DP4_C2M_P, DP4_M2C_N, DP4_M2C_P, DP5_C2M_N, DP5_C2M_P, DP5_M2C_N, DP5_M2C_P, DP6_C2M_N, DP6_C2M_P, DP6_M2C_N, DP6_M2C_P

### Notes on the sheet
- HPC connector J2 on bottom side
- HPC connector J1 on top side
- MGT DPx signals are routed within 5 ps differential pair length and 120 ps group matched lengths.
- Title:
- Project:
- Date:
- Website:
- Rev:
- Engineer:
- Sheet:
- /

### Library data of the parts
P1 = MC-HPC-10: MC-HPC-10, FMC High-pin count connector, lead free, 400 I/Os, male, 10 mm mated stack height; Manufacturer: Samtec; Manufacturer Ref: SEAM-40-03.5-S-10-2-A-K-TR-VITA57.0; Pitch: 1.27 mm; Mated Stack Height: 10 mm; Solder Type: Lead-Free; Number I/O: 400; PartName: ASP-134488-01; Part: ASP-134488-01; Vita PartNumber: MC-HPC-10; Pin Count: High; Gender: male; Supplier 1: Digi-Key; Supplier Part Number 1: SAM8730-ND
P2 = CC-HPC-10: CC-HPC-10, FMC High-pin count connector, lead free, 400 I/Os, female, 10 mm mated stack height; Manufacturer: Samtec; Manufacturer Ref: SEAF-40-06.5-10-A; Pitch: 1.27 mm; Mated Stack Height: 10 mm; Solder Type: Lead-Free; Number I/O: 400; PartName: ASP-134486-01; Part: ASP-134486-01; Vita PartNumber: CC-HPC-10; Pin Count: High; Gender: female; Supplier 1: Digi-Key; Supplier Part Number 1: SAM8728-ND

## Sheet FMC_HPC_UFL_DEBUG_HPC_CD.SchDoc: HPC connector ROW C and ROW D, Testpoints for I2C and JTAG bus signals
size A4; Date: 13.12.2024; ApprovedBy: PFH; CompanyName: IAM Electronic GmbH; DrawnBy: PFH; Engineer: PFH; DocumentNumber: 6; Revision: A; SheetNumber: 6; SheetTotal: 9; Projekt: FMC HPC-U.FL Debug Board; Website: www.fmchub.com
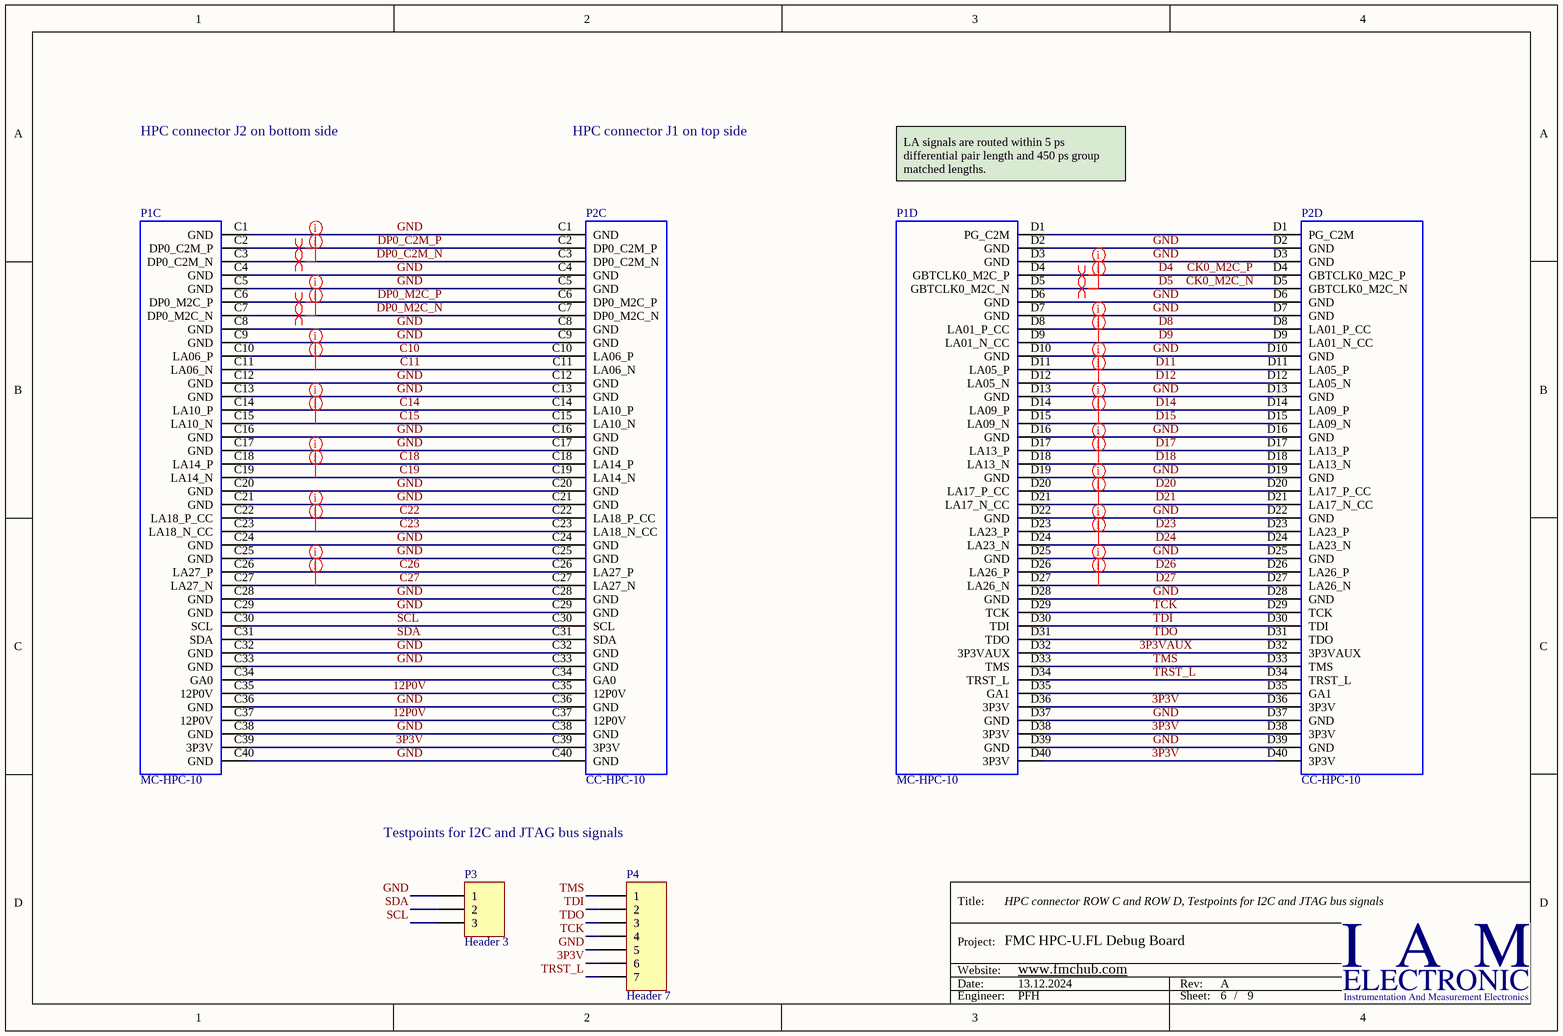
[diagram p5: FMC_HPC_UFL_DEBUG_HPC_CD.SchDoc]

### Parts
P1  MC-HPC-10  [ASP-134488-01]  (parts C,D of 10)
P2  CC-HPC-10  [ASP-134486-01]  (parts C,D of 10)
P3  Header 3  [HDR1X3]  (no BOM)
P4  Header 7  [HDR1X7]  (no BOM)

### Nets
GND: P1.C1(GND) P1.C4(GND) P1.C5(GND) P1.C8(GND) P1.C9(GND) P1.C12(GND) P1.C13(GND) P1.C16(GND) P1.C17(GND) P1.C20(GND) P1.C21(GND) P1.C24(GND) P1.C25(GND) P1.C28(GND) P1.C29(GND) P1.C32(GND) P1.C33(GND) P1.C36(GND) P1.C38(GND) P1.C40(GND) P1.D2(GND) P1.D3(GND) P1.D6(GND) P1.D7(GND) P1.D10(GND) P1.D13(GND) P1.D16(GND) P1.D19(GND) P1.D22(GND) P1.D25(GND) P1.D28(GND) P1.D37(GND) P1.D39(GND) P2.C1(GND) P2.C4(GND) P2.C5(GND) P2.C8(GND) P2.C9(GND) P2.C12(GND) P2.C13(GND) P2.C16(GND) P2.C17(GND) P2.C20(GND) P2.C21(GND) P2.C24(GND) P2.C25(GND) P2.C28(GND) P2.C29(GND) P2.C32(GND) P2.C33(GND) P2.C36(GND) P2.C38(GND) P2.C40(GND) P2.D2(GND) P2.D3(GND) P2.D6(GND) P2.D7(GND) P2.D10(GND) P2.D13(GND) P2.D16(GND) P2.D19(GND) P2.D22(GND) P2.D25(GND) P2.D28(GND) P2.D37(GND) P2.D39(GND) P3.1 P4.5
3P3V: P1.C39(3P3V) P1.D36(3P3V) P1.D38(3P3V) P1.D40(3P3V) P2.C39(3P3V) P2.D36(3P3V) P2.D38(3P3V) P2.D40(3P3V) P4.6
3P3VAUX: P1.D32(3P3VAUX) P2.D32(3P3VAUX)
12P0V: P1.C35(12P0V) P1.C37(12P0V) P2.C35(12P0V) P2.C37(12P0V)
C10: P1.C10(LA06_P) P2.C10(LA06_P)
C11: P1.C11(LA06_N) P2.C11(LA06_N)
C14: P1.C14(LA10_P) P2.C14(LA10_P)
C15: P1.C15(LA10_N) P2.C15(LA10_N)
C18: P1.C18(LA14_P) P2.C18(LA14_P)
C19: P1.C19(LA14_N) P2.C19(LA14_N)
C22: P1.C22(LA18_P_CC) P2.C22(LA18_P_CC)
C23: P1.C23(LA18_N_CC) P2.C23(LA18_N_CC)
C26: P1.C26(LA27_P) P2.C26(LA27_P)
C27: P1.C27(LA27_N) P2.C27(LA27_N)
CK0_M2C_N: P1.D5(GBTCLK0_M2C_N) P2.D5(GBTCLK0_M2C_N)  [also labelled D5]
CK0_M2C_P: P1.D4(GBTCLK0_M2C_P) P2.D4(GBTCLK0_M2C_P)  [also labelled D4]
D8: P1.D8(LA01_P_CC) P2.D8(LA01_P_CC)
D9: P1.D9(LA01_N_CC) P2.D9(LA01_N_CC)
D11: P1.D11(LA05_P) P2.D11(LA05_P)
D12: P1.D12(LA05_N) P2.D12(LA05_N)
D14: P1.D14(LA09_P) P2.D14(LA09_P)
D15: P1.D15(LA09_N) P2.D15(LA09_N)
D17: P1.D17(LA13_P) P2.D17(LA13_P)
D18: P1.D18(LA13_N) P2.D18(LA13_N)
D20: P1.D20(LA17_P_CC) P2.D20(LA17_P_CC)
D21: P1.D21(LA17_N_CC) P2.D21(LA17_N_CC)
D23: P1.D23(LA23_P) P2.D23(LA23_P)
D24: P1.D24(LA23_N) P2.D24(LA23_N)
D26: P1.D26(LA26_P) P2.D26(LA26_P)
D27: P1.D27(LA26_N) P2.D27(LA26_N)
DP0_C2M_N: P1.C3(DP0_C2M_N) P2.C3(DP0_C2M_N)
DP0_C2M_P: P1.C2(DP0_C2M_P) P2.C2(DP0_C2M_P)
DP0_M2C_N: P1.C7(DP0_M2C_N) P2.C7(DP0_M2C_N)
DP0_M2C_P: P1.C6(DP0_M2C_P) P2.C6(DP0_M2C_P)
SCL: P1.C30(SCL) P2.C30(SCL) P3.3
SDA: P1.C31(SDA) P2.C31(SDA) P3.2
TCK: P1.D29(TCK) P2.D29(TCK) P4.4
TDI: P1.D30(TDI) P2.D30(TDI) P4.2
TDO: P1.D31(TDO) P2.D31(TDO) P4.3
TMS: P1.D33(TMS) P2.D33(TMS) P4.1
TRST_L: P1.D34(TRST_L) P2.D34(TRST_L) P4.7
NetP1_C34: P1.C34(GA0) P2.C34(GA0)
NetP1_D1: P1.D1(PG_C2M) P2.D1(PG_C2M)
NetP1_D35: P1.D35(GA1) P2.D35(GA1)

### Layout directives
differential pair: CK0_M2C_N, CK0_M2C_P, DP0_C2M_N, DP0_C2M_P, DP0_M2C_N, DP0_M2C_P
net class MGT; rule Differential Pairs Routing [Pref Gap = 6mil    Min Gap  = 6mil    Max Gap  = 6milPref Width = 6mil    Min Width  = 4mil    Max Width  = 6mil]; rule Matched Net Lengths [Delay Tolerance = 120ps]: CK0_M2C_N, CK0_M2C_P, DP0_C2M_N, DP0_C2M_P, DP0_M2C_N, DP0_M2C_P
rule Width Constraint [Pref Impedance = 50,00ohms    Min Impedance = 50,00ohms    Max Impedance = 50,00ohms]; net class FMC_LA: C10, C11, C14, C15, C18, C19, C22, C23, C26, C27, D8, D9, D11, D12, D14, D15, D17, D18, D20, D21, D23, D24, D26, D27

### Notes on the sheet
- HPC connector J2 on bottom side
- HPC connector J1 on top side
- LA signals are routed within 5 ps differential pair length and 450 ps group matched lengths.
- Testpoints for I2C and JTAG bus signals
- Title:
- Project:
- Date:
- Website:
- Rev:
- Engineer:
- Sheet:
- /

### Library data of the parts
P1 = MC-HPC-10: as P1 on sheet FMC_HPC_UFL_DEBUG_HPC_AB; PartName: ASP-134488-01; Part: ASP-134488-01; Vita PartNumber: MC-HPC-10; Pin Count: High; Gender: male; Supplier 1: Digi-Key; Supplier Part Number 1: SAM8730-ND
P2 = CC-HPC-10: as P2 on sheet FMC_HPC_UFL_DEBUG_HPC_AB; PartName: ASP-134486-01; Part: ASP-134486-01; Vita PartNumber: CC-HPC-10; Pin Count: High; Gender: female; Supplier 1: Digi-Key; Supplier Part Number 1: SAM8728-ND
P3 = Header 3: Header, 3-Pin; LatestRevisionDate: 17-Jul-2002; LatestRevisionNote: Re-released for DXP Platform.; Publisher: Altium Limited
P4 = Header 7: Header, 7-Pin; LatestRevisionDate: 17-Jul-2002; LatestRevisionNote: Re-released for DXP Platform.; Publisher: Altium Limited

## Sheet FMC_HPC_UFL_DEBUG_HPC_EF.SchDoc: HPC connector ROW E and ROW F, Testpoints for power supplies
size A4; Date: 13.12.2024; ApprovedBy: PFH; CompanyName: IAM Electronic GmbH; DrawnBy: PFH; Engineer: PFH; DocumentNumber: 7; Revision: A; SheetNumber: 7; SheetTotal: 9; Projekt: FMC HPC-U.FL Debug Board; Website: www.fmchub.com
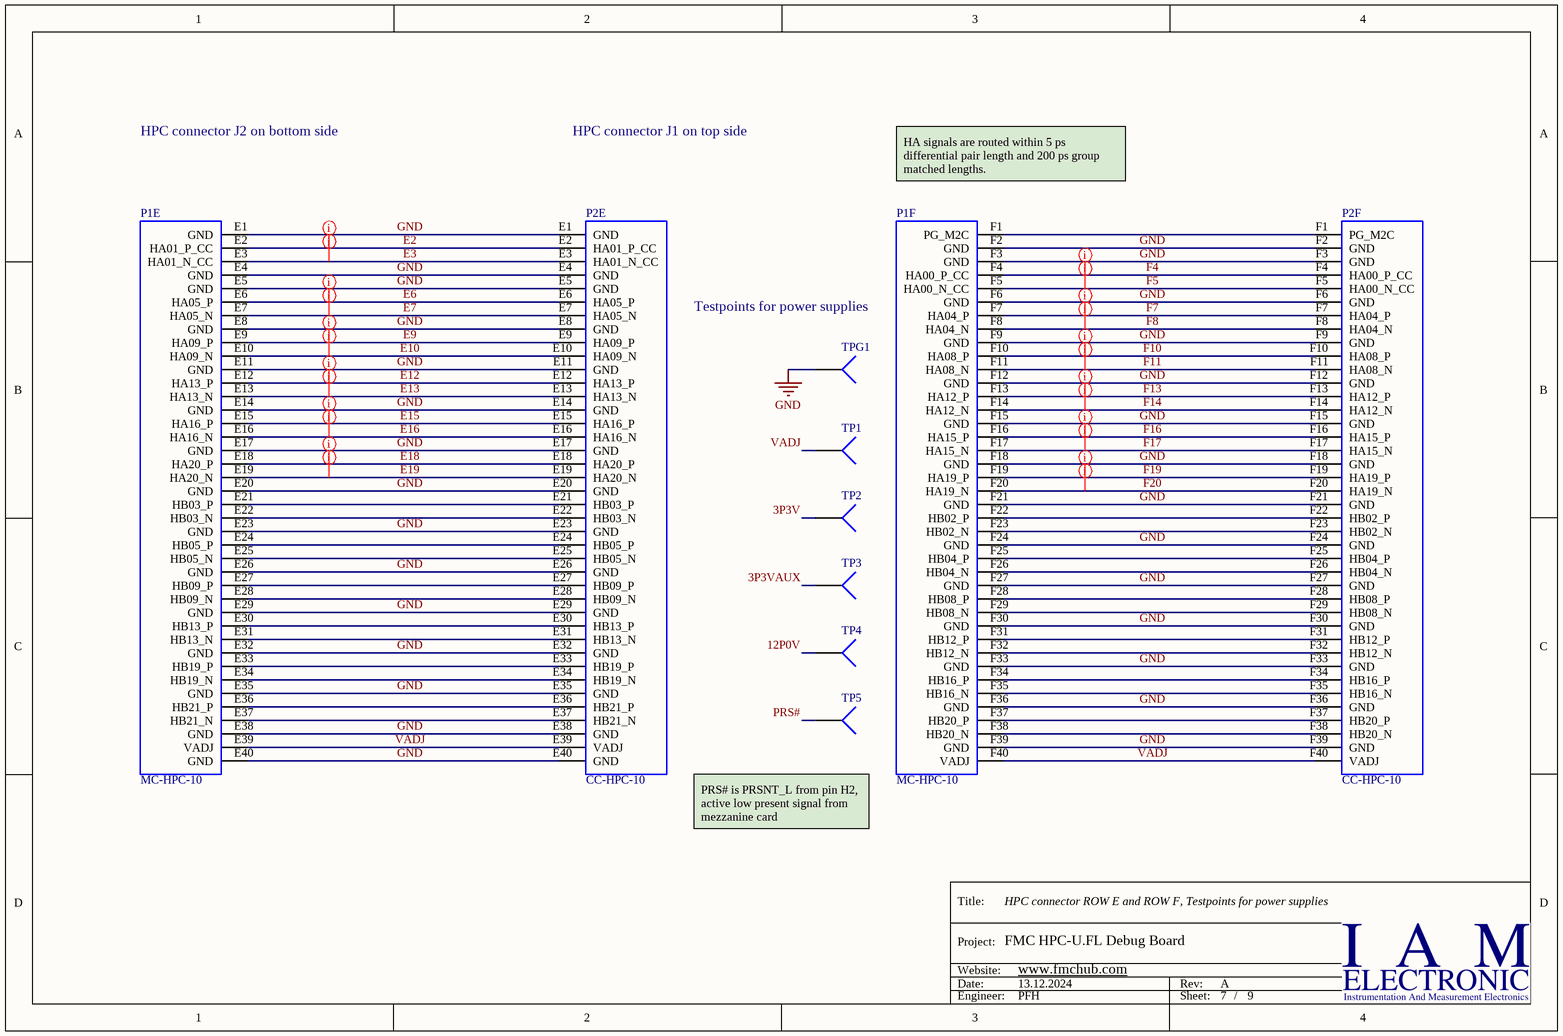
[diagram p6: FMC_HPC_UFL_DEBUG_HPC_EF.SchDoc]

### Parts
P1  MC-HPC-10  [ASP-134488-01]  (parts E,F of 10)
P2  CC-HPC-10  [ASP-134486-01]  (parts E,F of 10)
TP1  (no value)  [PIN1]  (no BOM)
TP2  (no value)  [PIN1]  (no BOM)
TP3  (no value)  [PIN1]  (no BOM)
TP4  (no value)  [PIN1]  (no BOM)
TP5  (no value)  [PIN1]  (no BOM)
TPG1  (no value)  [PIN1]  (no BOM)

### Nets
GND: P1.E1(GND) P1.E4(GND) P1.E5(GND) P1.E8(GND) P1.E11(GND) P1.E14(GND) P1.E17(GND) P1.E20(GND) P1.E23(GND) P1.E26(GND) P1.E29(GND) P1.E32(GND) P1.E35(GND) P1.E38(GND) P1.E40(GND) P1.F2(GND) P1.F3(GND) P1.F6(GND) P1.F9(GND) P1.F12(GND) P1.F15(GND) P1.F18(GND) P1.F21(GND) P1.F24(GND) P1.F27(GND) P1.F30(GND) P1.F33(GND) P1.F36(GND) P1.F39(GND) P2.E1(GND) P2.E4(GND) P2.E5(GND) P2.E8(GND) P2.E11(GND) P2.E14(GND) P2.E17(GND) P2.E20(GND) P2.E23(GND) P2.E26(GND) P2.E29(GND) P2.E32(GND) P2.E35(GND) P2.E38(GND) P2.E40(GND) P2.F2(GND) P2.F3(GND) P2.F6(GND) P2.F9(GND) P2.F12(GND) P2.F15(GND) P2.F18(GND) P2.F21(GND) P2.F24(GND) P2.F27(GND) P2.F30(GND) P2.F33(GND) P2.F36(GND) P2.F39(GND) TPG1.1
3P3V: TP2.1
3P3VAUX: TP3.1
12P0V: TP4.1
E2: P1.E2(HA01_P_CC) P2.E2(HA01_P_CC)
E3: P1.E3(HA01_N_CC) P2.E3(HA01_N_CC)
E6: P1.E6(HA05_P) P2.E6(HA05_P)
E7: P1.E7(HA05_N) P2.E7(HA05_N)
E9: P1.E9(HA09_P) P2.E9(HA09_P)
E10: P1.E10(HA09_N) P2.E10(HA09_N)
E12: P1.E12(HA13_P) P2.E12(HA13_P)
E13: P1.E13(HA13_N) P2.E13(HA13_N)
E15: P1.E15(HA16_P) P2.E15(HA16_P)
E16: P1.E16(HA16_N) P2.E16(HA16_N)
E18: P1.E18(HA20_P) P2.E18(HA20_P)
E19: P1.E19(HA20_N) P2.E19(HA20_N)
F4: P1.F4(HA00_P_CC) P2.F4(HA00_P_CC)
F5: P1.F5(HA00_N_CC) P2.F5(HA00_N_CC)
F7: P1.F7(HA04_P) P2.F7(HA04_P)
F8: P1.F8(HA04_N) P2.F8(HA04_N)
F10: P1.F10(HA08_P) P2.F10(HA08_P)
F11: P1.F11(HA08_N) P2.F11(HA08_N)
F13: P1.F13(HA12_P) P2.F13(HA12_P)
F14: P1.F14(HA12_N) P2.F14(HA12_N)
F16: P1.F16(HA15_P) P2.F16(HA15_P)
F17: P1.F17(HA15_N) P2.F17(HA15_N)
F19: P1.F19(HA19_P) P2.F19(HA19_P)
F20: P1.F20(HA19_N) P2.F20(HA19_N)
PRS#: TP5.1
VADJ: P1.E39(VADJ) P1.F40(VADJ) P2.E39(VADJ) P2.F40(VADJ) TP1.1
NetP1_E21: P1.E21(HB03_P) P2.E21(HB03_P)
NetP1_E22: P1.E22(HB03_N) P2.E22(HB03_N)
NetP1_E24: P1.E24(HB05_P) P2.E24(HB05_P)
NetP1_E25: P1.E25(HB05_N) P2.E25(HB05_N)
NetP1_E27: P1.E27(HB09_P) P2.E27(HB09_P)
NetP1_E28: P1.E28(HB09_N) P2.E28(HB09_N)
NetP1_E30: P1.E30(HB13_P) P2.E30(HB13_P)
NetP1_E31: P1.E31(HB13_N) P2.E31(HB13_N)
NetP1_E33: P1.E33(HB19_P) P2.E33(HB19_P)
NetP1_E34: P1.E34(HB19_N) P2.E34(HB19_N)
NetP1_E36: P1.E36(HB21_P) P2.E36(HB21_P)
NetP1_E37: P1.E37(HB21_N) P2.E37(HB21_N)
NetP1_F1: P1.F1(PG_M2C) P2.F1(PG_M2C)
NetP1_F22: P1.F22(HB02_P) P2.F22(HB02_P)
NetP1_F23: P1.F23(HB02_N) P2.F23(HB02_N)
NetP1_F25: P1.F25(HB04_P) P2.F25(HB04_P)
NetP1_F26: P1.F26(HB04_N) P2.F26(HB04_N)
NetP1_F28: P1.F28(HB08_P) P2.F28(HB08_P)
NetP1_F29: P1.F29(HB08_N) P2.F29(HB08_N)
NetP1_F31: P1.F31(HB12_P) P2.F31(HB12_P)
NetP1_F32: P1.F32(HB12_N) P2.F32(HB12_N)
NetP1_F34: P1.F34(HB16_P) P2.F34(HB16_P)
NetP1_F35: P1.F35(HB16_N) P2.F35(HB16_N)
NetP1_F37: P1.F37(HB20_P) P2.F37(HB20_P)
NetP1_F38: P1.F38(HB20_N) P2.F38(HB20_N)

### Layout directives
rule Width Constraint [Pref Impedance = 50,00ohms    Min Impedance = 50,00ohms    Max Impedance = 50,00ohms]; net class FMC_HA: E2, E3, E6, E7, E9, E10, E12, E13, E15, E16, E18, E19, F4, F5, F7, F8, F10, F11, F13, F14, F16, F17, F19, F20

### Notes on the sheet
- HPC connector J2 on bottom side
- HPC connector J1 on top side
- HA signals are routed within 5 ps differential pair length and 200 ps group matched lengths.
- Testpoints for power supplies
- PRS# is PRSNT_L from pin H2, active low present signal from mezzanine card
- Title:
- Project:
- Date:
- Website:
- Rev:
- Engineer:
- Sheet:
- /

### Library data of the parts
P1 = MC-HPC-10: as P1 on sheet FMC_HPC_UFL_DEBUG_HPC_AB; PartName: ASP-134488-01; Part: ASP-134488-01; Vita PartNumber: MC-HPC-10; Pin Count: High; Gender: male; Supplier 1: Digi-Key; Supplier Part Number 1: SAM8730-ND
P2 = CC-HPC-10: as P2 on sheet FMC_HPC_UFL_DEBUG_HPC_AB; PartName: ASP-134486-01; Part: ASP-134486-01; Vita PartNumber: CC-HPC-10; Pin Count: High; Gender: female; Supplier 1: Digi-Key; Supplier Part Number 1: SAM8728-ND
TP1-TP5 TPG1 = Socket: LatestRevisionDate: 17-Jul-2002; LatestRevisionNote: Re-released for DXP Platform.; Publisher: Altium Limited

## Sheet FMC_HPC_UFL_DEBUG_HPC_GH.SchDoc: HPC connector ROW G and ROW H
size A4; Date: 13.12.2024; ApprovedBy: PFH; CompanyName: IAM Electronic GmbH; DrawnBy: PFH; Engineer: PFH; DocumentNumber: 8; Revision: A; SheetNumber: 8; SheetTotal: 9; Projekt: FMC HPC-U.FL Debug Board; Website: www.fmchub.com
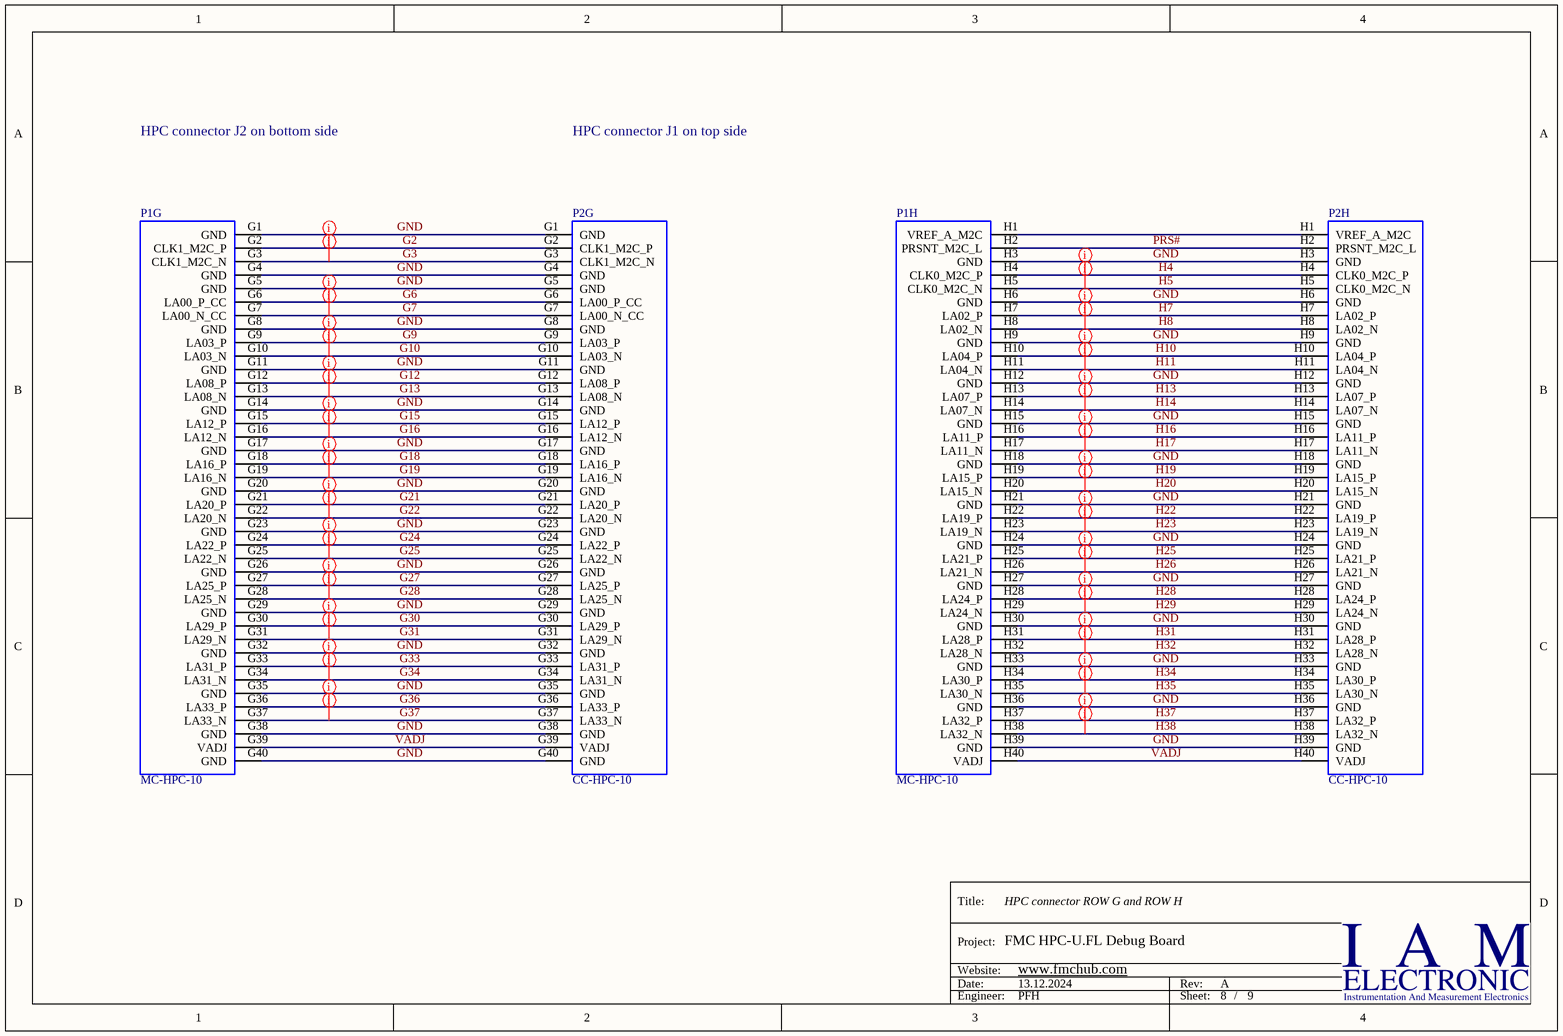
[diagram p7: FMC_HPC_UFL_DEBUG_HPC_GH.SchDoc]

### Parts
P1  MC-HPC-10  [ASP-134488-01]  (parts G,H of 10)
P2  CC-HPC-10  [ASP-134486-01]  (parts G,H of 10)

### Nets
GND: P1.G1(GND) P1.G4(GND) P1.G5(GND) P1.G8(GND) P1.G11(GND) P1.G14(GND) P1.G17(GND) P1.G20(GND) P1.G23(GND) P1.G26(GND) P1.G29(GND) P1.G32(GND) P1.G35(GND) P1.G38(GND) P1.G40(GND) P1.H3(GND) P1.H6(GND) P1.H9(GND) P1.H12(GND) P1.H15(GND) P1.H18(GND) P1.H21(GND) P1.H24(GND) P1.H27(GND) P1.H30(GND) P1.H33(GND) P1.H36(GND) P1.H39(GND) P2.G1(GND) P2.G4(GND) P2.G5(GND) P2.G8(GND) P2.G11(GND) P2.G14(GND) P2.G17(GND) P2.G20(GND) P2.G23(GND) P2.G26(GND) P2.G29(GND) P2.G32(GND) P2.G35(GND) P2.G38(GND) P2.G40(GND) P2.H3(GND) P2.H6(GND) P2.H9(GND) P2.H12(GND) P2.H15(GND) P2.H18(GND) P2.H21(GND) P2.H24(GND) P2.H27(GND) P2.H30(GND) P2.H33(GND) P2.H36(GND) P2.H39(GND)
G2: P1.G2(CLK1_M2C_P) P2.G2(CLK1_M2C_P)
G3: P1.G3(CLK1_M2C_N) P2.G3(CLK1_M2C_N)
G6: P1.G6(LA00_P_CC) P2.G6(LA00_P_CC)
G7: P1.G7(LA00_N_CC) P2.G7(LA00_N_CC)
G9: P1.G9(LA03_P) P2.G9(LA03_P)
G10: P1.G10(LA03_N) P2.G10(LA03_N)
G12: P1.G12(LA08_P) P2.G12(LA08_P)
G13: P1.G13(LA08_N) P2.G13(LA08_N)
G15: P1.G15(LA12_P) P2.G15(LA12_P)
G16: P1.G16(LA12_N) P2.G16(LA12_N)
G18: P1.G18(LA16_P) P2.G18(LA16_P)
G19: P1.G19(LA16_N) P2.G19(LA16_N)
G21: P1.G21(LA20_P) P2.G21(LA20_P)
G22: P1.G22(LA20_N) P2.G22(LA20_N)
G24: P1.G24(LA22_P) P2.G24(LA22_P)
G25: P1.G25(LA22_N) P2.G25(LA22_N)
G27: P1.G27(LA25_P) P2.G27(LA25_P)
G28: P1.G28(LA25_N) P2.G28(LA25_N)
G30: P1.G30(LA29_P) P2.G30(LA29_P)
G31: P1.G31(LA29_N) P2.G31(LA29_N)
G33: P1.G33(LA31_P) P2.G33(LA31_P)
G34: P1.G34(LA31_N) P2.G34(LA31_N)
G36: P1.G36(LA33_P) P2.G36(LA33_P)
G37: P1.G37(LA33_N) P2.G37(LA33_N)
H4: P1.H4(CLK0_M2C_P) P2.H4(CLK0_M2C_P)
H5: P1.H5(CLK0_M2C_N) P2.H5(CLK0_M2C_N)
H7: P1.H7(LA02_P) P2.H7(LA02_P)
H8: P1.H8(LA02_N) P2.H8(LA02_N)
H10: P1.H10(LA04_P) P2.H10(LA04_P)
H11: P1.H11(LA04_N) P2.H11(LA04_N)
H13: P1.H13(LA07_P) P2.H13(LA07_P)
H14: P1.H14(LA07_N) P2.H14(LA07_N)
H16: P1.H16(LA11_P) P2.H16(LA11_P)
H17: P1.H17(LA11_N) P2.H17(LA11_N)
H19: P1.H19(LA15_P) P2.H19(LA15_P)
H20: P1.H20(LA15_N) P2.H20(LA15_N)
H22: P1.H22(LA19_P) P2.H22(LA19_P)
H23: P1.H23(LA19_N) P2.H23(LA19_N)
H25: P1.H25(LA21_P) P2.H25(LA21_P)
H26: P1.H26(LA21_N) P2.H26(LA21_N)
H28: P1.H28(LA24_P) P2.H28(LA24_P)
H29: P1.H29(LA24_N) P2.H29(LA24_N)
H31: P1.H31(LA28_P) P2.H31(LA28_P)
H32: P1.H32(LA28_N) P2.H32(LA28_N)
H34: P1.H34(LA30_P) P2.H34(LA30_P)
H35: P1.H35(LA30_N) P2.H35(LA30_N)
H37: P1.H37(LA32_P) P2.H37(LA32_P)
H38: P1.H38(LA32_N) P2.H38(LA32_N)
PRS#: P1.H2(PRSNT_M2C_L) P2.H2(PRSNT_M2C_L)
VADJ: P1.G39(VADJ) P1.H40(VADJ) P2.G39(VADJ) P2.H40(VADJ)
NetP1_H1: P1.H1(VREF_A_M2C) P2.H1(VREF_A_M2C)

### Layout directives
rule Width Constraint [Pref Impedance = 50,00ohms    Min Impedance = 50,00ohms    Max Impedance = 50,00ohms]; net class FMC_LA: G6, G7, G9, G10, G12, G13, G15, G16, G18, G19, G21, G22, G24, G25, G27, G28, G30, G31, G33, G34, G36, G37, H7, H8, H10, H11, H13, H14, H16, H17, H19, H20, H22, H23, H25, H26, H28, H29, H31, H32, H34, H35, H37, H38
rule Width Constraint [Pref Impedance = 50,00ohms    Min Impedance = 50,00ohms    Max Impedance = 50,00ohms]; net class FMC_CLK: G2, G3, H4, H5

### Notes on the sheet
- HPC connector J2 on bottom side
- HPC connector J1 on top side
- Title:
- Project:
- Date:
- Website:
- Rev:
- Engineer:
- Sheet:
- /

### Library data of the parts
P1 = MC-HPC-10: as P1 on sheet FMC_HPC_UFL_DEBUG_HPC_AB; PartName: ASP-134488-01; Part: ASP-134488-01; Vita PartNumber: MC-HPC-10; Pin Count: High; Gender: male; Supplier 1: Digi-Key; Supplier Part Number 1: SAM8730-ND
P2 = CC-HPC-10: as P2 on sheet FMC_HPC_UFL_DEBUG_HPC_AB; PartName: ASP-134486-01; Part: ASP-134486-01; Vita PartNumber: CC-HPC-10; Pin Count: High; Gender: female; Supplier 1: Digi-Key; Supplier Part Number 1: SAM8728-ND

## Sheet FMC_HPC_UFL_DEBUG_HPC_JK.SchDoc: HPC connector ROW J and ROW K
size A4; Date: 13.12.2024; ApprovedBy: PFH; CompanyName: IAM Electronic GmbH; DrawnBy: PFH; Engineer: PFH; DocumentNumber: 9; Revision: A; SheetNumber: 9; SheetTotal: 9; Projekt: FMC HPC-U.FL Debug Board; Website: www.fmchub.com
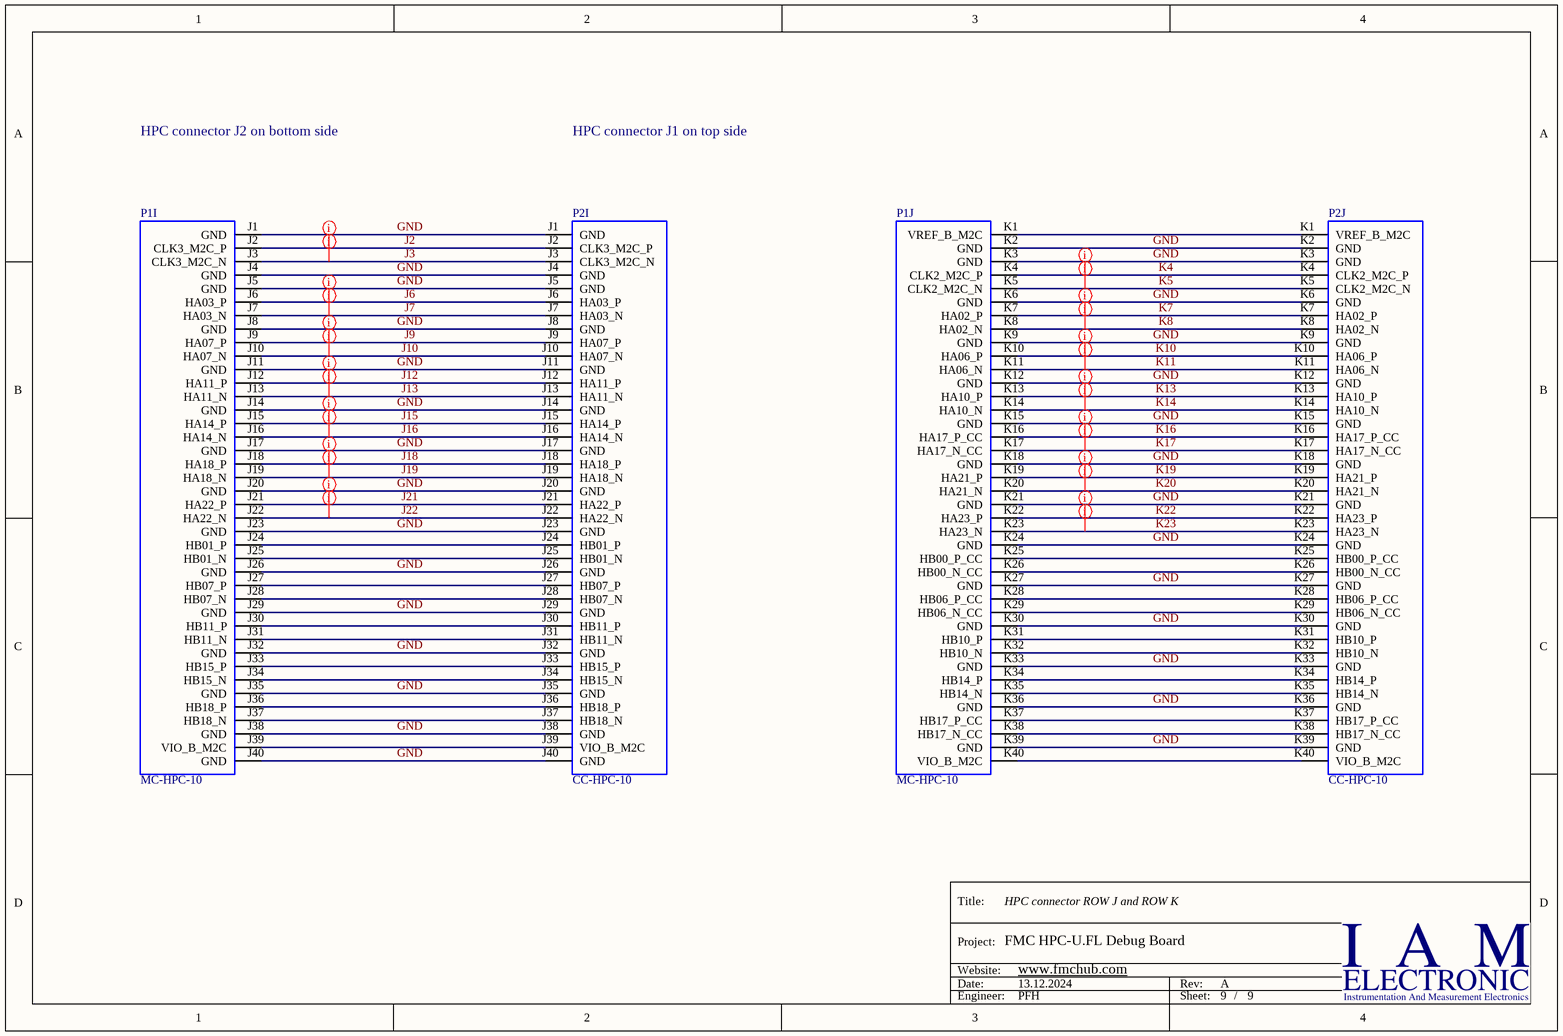
[diagram p8: FMC_HPC_UFL_DEBUG_HPC_JK.SchDoc]

### Parts
P1  MC-HPC-10  [ASP-134488-01]  (parts I,J of 10)
P2  CC-HPC-10  [ASP-134486-01]  (parts I,J of 10)

### Nets
GND: P1.J1(GND) P1.J4(GND) P1.J5(GND) P1.J8(GND) P1.J11(GND) P1.J14(GND) P1.J17(GND) P1.J20(GND) P1.J23(GND) P1.J26(GND) P1.J29(GND) P1.J32(GND) P1.J35(GND) P1.J38(GND) P1.J40(GND) P1.K2(GND) P1.K3(GND) P1.K6(GND) P1.K9(GND) P1.K12(GND) P1.K15(GND) P1.K18(GND) P1.K21(GND) P1.K24(GND) P1.K27(GND) P1.K30(GND) P1.K33(GND) P1.K36(GND) P1.K39(GND) P2.J1(GND) P2.J4(GND) P2.J5(GND) P2.J8(GND) P2.J11(GND) P2.J14(GND) P2.J17(GND) P2.J20(GND) P2.J23(GND) P2.J26(GND) P2.J29(GND) P2.J32(GND) P2.J35(GND) P2.J38(GND) P2.J40(GND) P2.K2(GND) P2.K3(GND) P2.K6(GND) P2.K9(GND) P2.K12(GND) P2.K15(GND) P2.K18(GND) P2.K21(GND) P2.K24(GND) P2.K27(GND) P2.K30(GND) P2.K33(GND) P2.K36(GND) P2.K39(GND)
J2: P1.J2(CLK3_M2C_P) P2.J2(CLK3_M2C_P)
J3: P1.J3(CLK3_M2C_N) P2.J3(CLK3_M2C_N)
J6: P1.J6(HA03_P) P2.J6(HA03_P)
J7: P1.J7(HA03_N) P2.J7(HA03_N)
J9: P1.J9(HA07_P) P2.J9(HA07_P)
J10: P1.J10(HA07_N) P2.J10(HA07_N)
J12: P1.J12(HA11_P) P2.J12(HA11_P)
J13: P1.J13(HA11_N) P2.J13(HA11_N)
J15: P1.J15(HA14_P) P2.J15(HA14_P)
J16: P1.J16(HA14_N) P2.J16(HA14_N)
J18: P1.J18(HA18_P) P2.J18(HA18_P)
J19: P1.J19(HA18_N) P2.J19(HA18_N)
J21: P1.J21(HA22_P) P2.J21(HA22_P)
J22: P1.J22(HA22_N) P2.J22(HA22_N)
K4: P1.K4(CLK2_M2C_P) P2.K4(CLK2_M2C_P)
K5: P1.K5(CLK2_M2C_N) P2.K5(CLK2_M2C_N)
K7: P1.K7(HA02_P) P2.K7(HA02_P)
K8: P1.K8(HA02_N) P2.K8(HA02_N)
K10: P1.K10(HA06_P) P2.K10(HA06_P)
K11: P1.K11(HA06_N) P2.K11(HA06_N)
K13: P1.K13(HA10_P) P2.K13(HA10_P)
K14: P1.K14(HA10_N) P2.K14(HA10_N)
K16: P1.K16(HA17_P_CC) P2.K16(HA17_P_CC)
K17: P1.K17(HA17_N_CC) P2.K17(HA17_N_CC)
K19: P1.K19(HA21_P) P2.K19(HA21_P)
K20: P1.K20(HA21_N) P2.K20(HA21_N)
K22: P1.K22(HA23_P) P2.K22(HA23_P)
K23: P1.K23(HA23_N) P2.K23(HA23_N)
NetP1_J24: P1.J24(HB01_P) P2.J24(HB01_P)
NetP1_J25: P1.J25(HB01_N) P2.J25(HB01_N)
NetP1_J27: P1.J27(HB07_P) P2.J27(HB07_P)
NetP1_J28: P1.J28(HB07_N) P2.J28(HB07_N)
NetP1_J30: P1.J30(HB11_P) P2.J30(HB11_P)
NetP1_J31: P1.J31(HB11_N) P2.J31(HB11_N)
NetP1_J33: P1.J33(HB15_P) P2.J33(HB15_P)
NetP1_J34: P1.J34(HB15_N) P2.J34(HB15_N)
NetP1_J36: P1.J36(HB18_P) P2.J36(HB18_P)
NetP1_J37: P1.J37(HB18_N) P2.J37(HB18_N)
NetP1_J39: P1.J39(VIO_B_M2C) P2.J39(VIO_B_M2C)
NetP1_K1: P1.K1(VREF_B_M2C) P2.K1(VREF_B_M2C)
NetP1_K25: P1.K25(HB00_P_CC) P2.K25(HB00_P_CC)
NetP1_K26: P1.K26(HB00_N_CC) P2.K26(HB00_N_CC)
NetP1_K28: P1.K28(HB06_P_CC) P2.K28(HB06_P_CC)
NetP1_K29: P1.K29(HB06_N_CC) P2.K29(HB06_N_CC)
NetP1_K31: P1.K31(HB10_P) P2.K31(HB10_P)
NetP1_K32: P1.K32(HB10_N) P2.K32(HB10_N)
NetP1_K34: P1.K34(HB14_P) P2.K34(HB14_P)
NetP1_K35: P1.K35(HB14_N) P2.K35(HB14_N)
NetP1_K37: P1.K37(HB17_P_CC) P2.K37(HB17_P_CC)
NetP1_K38: P1.K38(HB17_N_CC) P2.K38(HB17_N_CC)
NetP1_K40: P1.K40(VIO_B_M2C) P2.K40(VIO_B_M2C)

### Layout directives
rule Width Constraint [Pref Impedance = 50,00ohms    Min Impedance = 50,00ohms    Max Impedance = 50,00ohms]; net class FMC_CLK: J2, J3, K4, K5
rule Width Constraint [Pref Impedance = 50,00ohms    Min Impedance = 50,00ohms    Max Impedance = 50,00ohms]; net class FMC_HA: J6, J7, J9, J10, J12, J13, J15, J16, J18, J19, J21, J22, K7, K8, K10, K11, K13, K14, K16, K17, K19, K20, K22, K23

### Notes on the sheet
- HPC connector J2 on bottom side
- HPC connector J1 on top side
- Title:
- Project:
- Date:
- Website:
- Rev:
- Engineer:
- Sheet:
- /

### Library data of the parts
P1 = MC-HPC-10: as P1 on sheet FMC_HPC_UFL_DEBUG_HPC_AB; PartName: ASP-134488-01; Part: ASP-134488-01; Vita PartNumber: MC-HPC-10; Pin Count: High; Gender: male; Supplier 1: Digi-Key; Supplier Part Number 1: SAM8730-ND
P2 = CC-HPC-10: as P2 on sheet FMC_HPC_UFL_DEBUG_HPC_AB; PartName: ASP-134486-01; Part: ASP-134486-01; Vita PartNumber: CC-HPC-10; Pin Count: High; Gender: female; Supplier 1: Digi-Key; Supplier Part Number 1: SAM8728-ND